# Altium project Vanilla SBC.PrjPcb
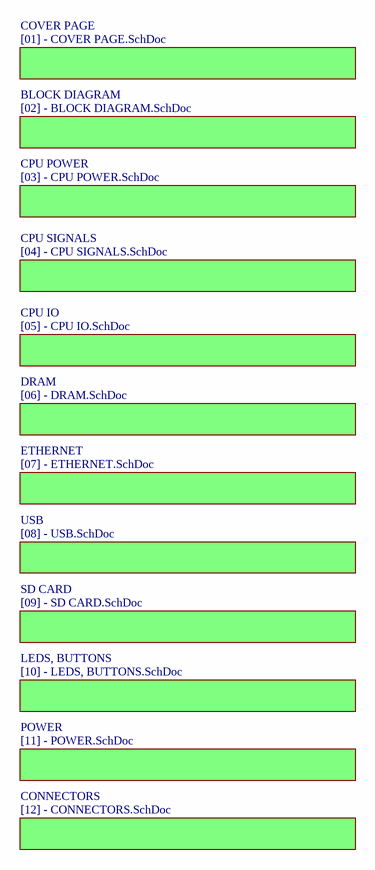
[diagram p0: Vanilla SCB.SchDoc]
13 sheets, 168 parts. Net scope: flat (ports and power ports of the same name join across sheets).
Board file: Vanilla SCB.PcbDoc
Sheets:
  Vanilla SCB.SchDoc
    COVER PAGE = [01] - COVER PAGE.SchDoc
    BLOCK DIAGRAM = [02] - BLOCK DIAGRAM.SchDoc
    CPU POWER = [03] - CPU POWER.SchDoc
    CPU SIGNALS = [04] - CPU SIGNALS.SchDoc
    CPU IO = [05] - CPU IO.SchDoc
    DRAM = [06] - DRAM.SchDoc
    ETHERNET = [07] - ETHERNET.SchDoc
    USB = [08] - USB.SchDoc
    SD CARD = [09] - SD CARD.SchDoc
    LEDS, BUTTONS = [10] - LEDS, BUTTONS.SchDoc
    POWER = [11] - POWER.SchDoc
    CONNECTORS = [12] - CONNECTORS.SchDoc

## Sheet Vanilla SCB.SchDoc: Vanilla SCB
size A4; Organization: Bjørn T. Brodtkorb; Address1: Frode Rinnans veg 161; Address2: 7050 Trondheim; DocumentNumber: 1; Revision: 1.0; SheetNumber: 1; SheetTotal: 13

### Sub-sheets
BLOCK DIAGRAM = [02] - BLOCK DIAGRAM.SchDoc: no entries
CONNECTORS = [12] - CONNECTORS.SchDoc: no entries
COVER PAGE = [01] - COVER PAGE.SchDoc: no entries
CPU IO = [05] - CPU IO.SchDoc: no entries
CPU POWER = [03] - CPU POWER.SchDoc: no entries
CPU SIGNALS = [04] - CPU SIGNALS.SchDoc: no entries
DRAM = [06] - DRAM.SchDoc: no entries
ETHERNET = [07] - ETHERNET.SchDoc: no entries
LEDS, BUTTONS = [10] - LEDS, BUTTONS.SchDoc: no entries
POWER = [11] - POWER.SchDoc: no entries
SD CARD = [09] - SD CARD.SchDoc: no entries
USB = [08] - USB.SchDoc: no entries

### Notes on the sheet
- Title
- Size:
- Date:
- A4
- Number:
- Time:
- Revision:
- Sheet
- of
- StrawberryHacker
- File:

## Sheet [01] - COVER PAGE.SchDoc: Vanilla SCB
size A4; Organization: Bjørn T. Brodtkorb; Address1: Frode Rinnans veg 161; Address2: 7050 Trondheim; DocumentNumber: 2; Revision: 1.0; SheetNumber: 2; SheetTotal: 13
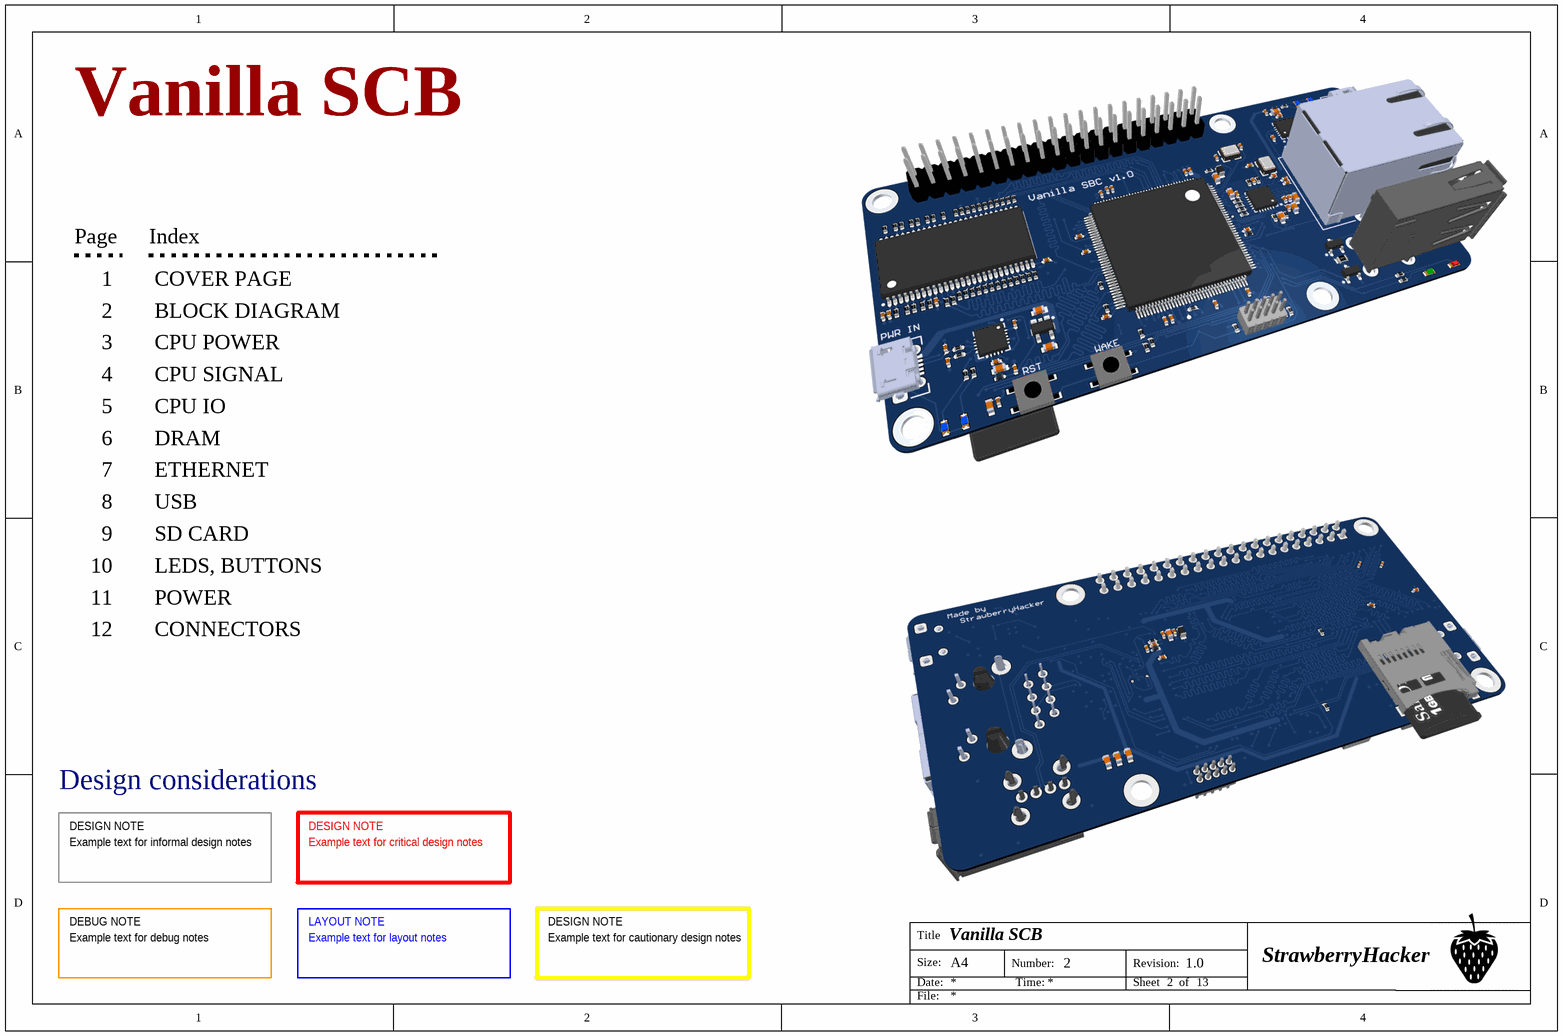
[diagram p1: [01] - COVER PAGE.SchDoc]

### Notes on the sheet
- Vanilla SCB
- Page
- Index
- 1
- COVER PAGE
- Top side
- 2
- 3
- 4
- BLOCK DIAGRAM
- CPU POWER
- CPU SIGNAL
- 5
- 6
- CPU IO
- DRAM
- 7
- 8
- ETHERNET
- USB
- 10
- 9
- SD CARD
- LEDS, BUTTONS
- 11
- 12
- POWER
- CONNECTORS
- Bottom side
- Design considerations
- DESIGN NOTE
- Example text for informal design notes
- Example text for critical design notes
- DEBUG NOTE
- Example text for debug notes
- LAYOUT NOTE
- Example text for layout notes
- Example text for cautionary design notes
- Title
- Size:
- Date:
- A4
- Number:
- Time:
- Revision:
- Sheet
- of
- StrawberryHacker
- File:

## Sheet [02] - BLOCK DIAGRAM.SchDoc: BLOCK DIAGRAM
size A4; Organization: Bjørn T. Brodtkorb; Address1: Frode Rinnans veg 161; Address2: 7050 Trondheim; DocumentNumber: 3; Revision: 1.0; SheetNumber: 3; SheetTotal: 13
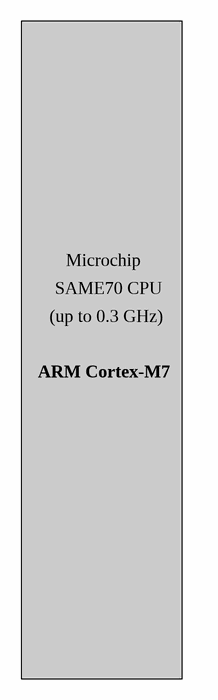
[diagram p2: [02] - BLOCK DIAGRAM.SchDoc]

### Notes on the sheet
- Microchip
- (up to 0.3 GHz)
- SAME70 CPU
- ARM Cortex-M7
- Title
- Size:
- Date:
- A4
- Number:
- Time:
- Revision:
- Sheet
- of
- StrawberryHacker
- File:

## Sheet [03] - CPU POWER.SchDoc: CPU POWER
size A4; Organization: Bjørn T. Brodtkorb; Address1: Frode Rinnans veg 161; Address2: 7050 Trondheim; DocumentNumber: 4; Revision: 1.0; SheetNumber: 4; SheetTotal: 13
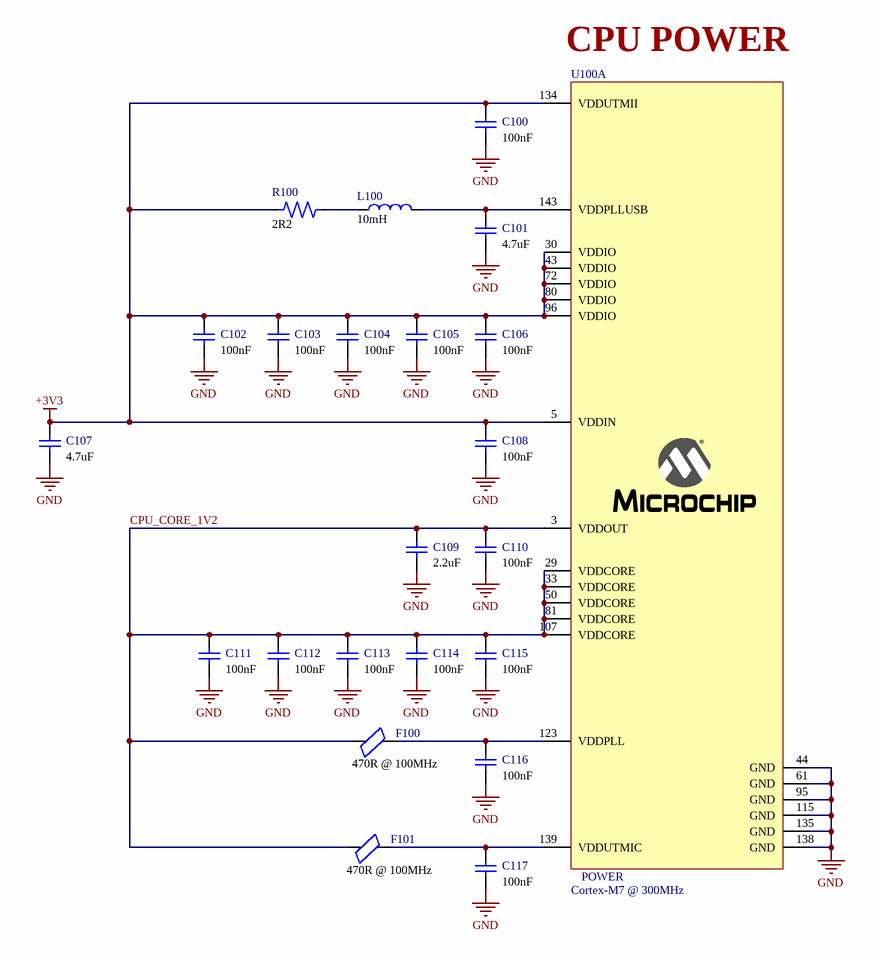
[diagram p3: [03] - CPU POWER.SchDoc]

### Parts
C100  value 100nF  [C0402]  (hidden comment: 04023C103KAT2A)
C101  value 4.7uF  [C0603]  (hidden comment: 02016D104KAT2A)
C102  value 100nF  [C0402]  (hidden comment: 04023C103KAT2A)
C103  value 100nF  [C0402]  (hidden comment: 04023C103KAT2A)
C104  value 100nF  [C0402]  (hidden comment: 04023C103KAT2A)
C105  value 100nF  [C0402]  (hidden comment: 04023C103KAT2A)
C106  value 100nF  [C0402]  (hidden comment: 04023C103KAT2A)
C107  value 4.7uF  [C0603]  (hidden comment: 02016D104KAT2A)
C108  value 100nF  [C0402]  (hidden comment: 04023C103KAT2A)
C109  value 2.2uF  [C0402]  (hidden comment: 04023C103KAT2A)
C110  value 100nF  [C0402]  (hidden comment: 04023C103KAT2A)
C111  value 100nF  [C0402]  (hidden comment: 04023C103KAT2A)
C112  value 100nF  [C0402]  (hidden comment: 04023C103KAT2A)
C113  value 100nF  [C0402]  (hidden comment: 04023C103KAT2A)
C114  value 100nF  [C0402]  (hidden comment: 04023C103KAT2A)
C115  value 100nF  [C0402]  (hidden comment: 04023C103KAT2A)
C116  value 100nF  [C0402]  (hidden comment: 04023C103KAT2A)
C117  value 100nF  [C0402]  (hidden comment: 04023C103KAT2A)
F100  value 470R @ 100MHz  [Ferrite bead 0402]  (hidden comment: BLM15AG102SN1D)
F101  value 470R @ 100MHz  [Ferrite bead 0402]  (hidden comment: BLM15AG102SN1D)
L100  value 10mH  [Inductor 0603]  (hidden comment: MLZ1608A2R2WT)
R100  value 2R2  [R0402]  (hidden comment: CRCW04020000Z0ED)
U100  Cortex-M7 @ 300MHz  [ATSAMS70Q21A-AN]  (part A of 4)

### Nets
+3V3: C100.2 C102.2 C103.2 C104.2 C105.2 C106.2 C107.2 C108.2 R100.1 U100.5(VDDIN) U100.30(VDDIO) U100.43(VDDIO) U100.72(VDDIO) U100.80(VDDIO) U100.96(VDDIO) U100.134(VDDUTMII)
GND: C100.1 C101.1 C102.1 C103.1 C104.1 C105.1 C106.1 C107.1 C108.1 C109.1 C110.1 C111.1 C112.1 C113.1 C114.1 C115.1 C116.1 C117.1 U100.44(GND) U100.61(GND) U100.95(GND) U100.115(GND) U100.135(GND) U100.138(GND)
CPU_CORE_1V2: C109.2 C110.2 C111.2 C112.2 C113.2 C114.2 C115.2 F100.1 F101.1 U100.3(VDDOUT) U100.29(VDDCORE) U100.33(VDDCORE) U100.50(VDDCORE) U100.81(VDDCORE) U100.107(VDDCORE)
NetC101_2: C101.2 L100.2 U100.143(VDDPLLUSB)
NetC116_2: C116.2 F100.2 U100.123(VDDPLL)
NetC117_2: C117.2 F101.2 U100.139(VDDUTMIC)
NetL100_1: L100.1 R100.2

### Notes on the sheet
- (near U100) CPU POWER
- Title
- Size:
- Date:
- A4
- Number:
- Time:
- Revision:
- Sheet
- of
- StrawberryHacker
- File:
- (in symbol ATSAMS70Q21A-AN, part A) POWER

### Library data of the parts
C100 C102-C106 C108-C117 = 04023C103KAT2A: C0402
C101 C107 = 02016D104KAT2A: C0603
F100 F101 = BLM15AG102SN1D: Ferrite bead 0402
L100 = MLZ1608A2R2WT: Inductor 0603
R100 = CRCW04020000Z0ED: R0402
U100 = ATSAMS70Q21A-AN: ATSAMS70Q21; Supplier Part Number 1: 2484397; Supplier 1: Farnell

## Sheet [04] - CPU SIGNALS.SchDoc: CPU SIGNALS
size A4; Organization: Bjørn T. Brodtkorb; Address1: Frode Rinnans veg 161; Address2: 7050 Trondheim; DocumentNumber: 5; Revision: 1.0; SheetNumber: 5; SheetTotal: 13
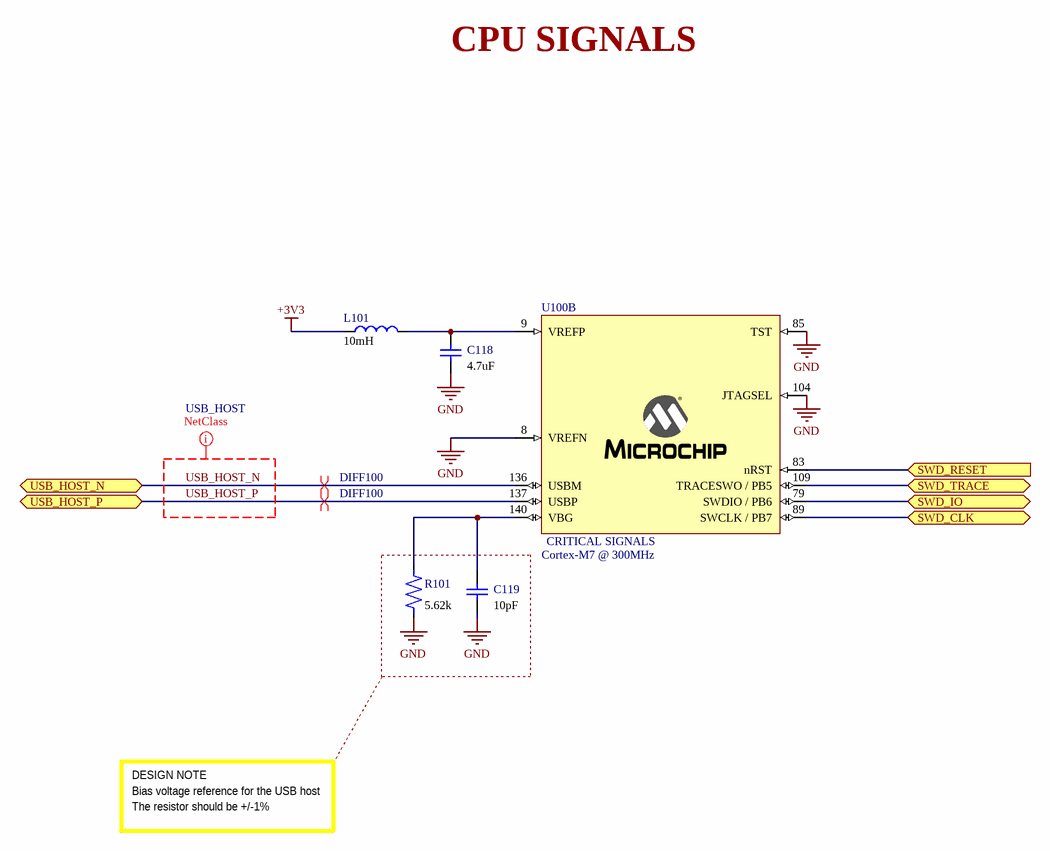
[diagram p4: [04] - CPU SIGNALS.SchDoc]

### Parts
C118  value 4.7uF  [C0402]  (hidden comment: 04023C103KAT2A)
C119  value 10pF  [C0402]  (hidden comment: 04023C103KAT2A)
L101  value 10mH  [Inductor 0603]  (hidden comment: MLZ1608A2R2WT)
R101  value 5.62k  [R0402]  (hidden comment: CRCW04020000Z0ED)
U100  Cortex-M7 @ 300MHz  [ATSAMS70Q21A-AN]  (part B of 4)

### Ports
SWD_CLK (bidir), SWD_IO (bidir), SWD_RESET (in), SWD_TRACE (bidir), USB_HOST_N (bidir), USB_HOST_P (bidir)

### Nets
+3V3: L101.1
GND: C118.1 C119.1 R101.1 U100.8(VREFN) U100.85(TST) U100.104(JTAGSEL)
USB_HOST_N: U100.136(USBM) ; port USB_HOST_N
USB_HOST_P: U100.137(USBP) ; port USB_HOST_P
NetC118_2: C118.2 L101.2 U100.9(VREFP)
NetC119_2: C119.2 R101.2 U100.140(VBG)
NetJ105_2: U100.79(SWDIO_/_PB6) ; port SWD_IO
NetJ105_4: U100.89(SWCLK_/_PB7) ; port SWD_CLK
NetJ105_6: U100.109(TRACESWO_/_PB5) ; port SWD_TRACE
NetJ105_10: U100.83(nRST) ; port SWD_RESET

### Layout directives
differential pair; differential pair class DIFF100: USB_HOST_N, USB_HOST_P
net class USB_HOST: USB_HOST_N, USB_HOST_P

### Notes on the sheet
- CPU SIGNALS
- DESIGN NOTE
- Bias voltage reference for the USB host
- The resistor should be +/-1%
- Title
- Size:
- Date:
- A4
- Number:
- Time:
- Revision:
- Sheet
- of
- StrawberryHacker
- File:
- (in symbol ATSAMS70Q21A-AN, part B) CRITICAL SIGNALS

### Library data of the parts
C118 C119 = 04023C103KAT2A: C0402
L101 = MLZ1608A2R2WT: Inductor 0603
R101 = CRCW04020000Z0ED: R0402
U100 = ATSAMS70Q21A-AN: ATSAMS70Q21; Supplier Part Number 1: 2484397; Supplier 1: Farnell

## Sheet [05] - CPU IO.SchDoc: CPU IO
size A4; Organization: Bjørn T. Brodtkorb; Address1: Frode Rinnans veg 161; Address2: 7050 Trondheim; DocumentNumber: 6; Revision: 1.0; SheetNumber: 6; SheetTotal: 13
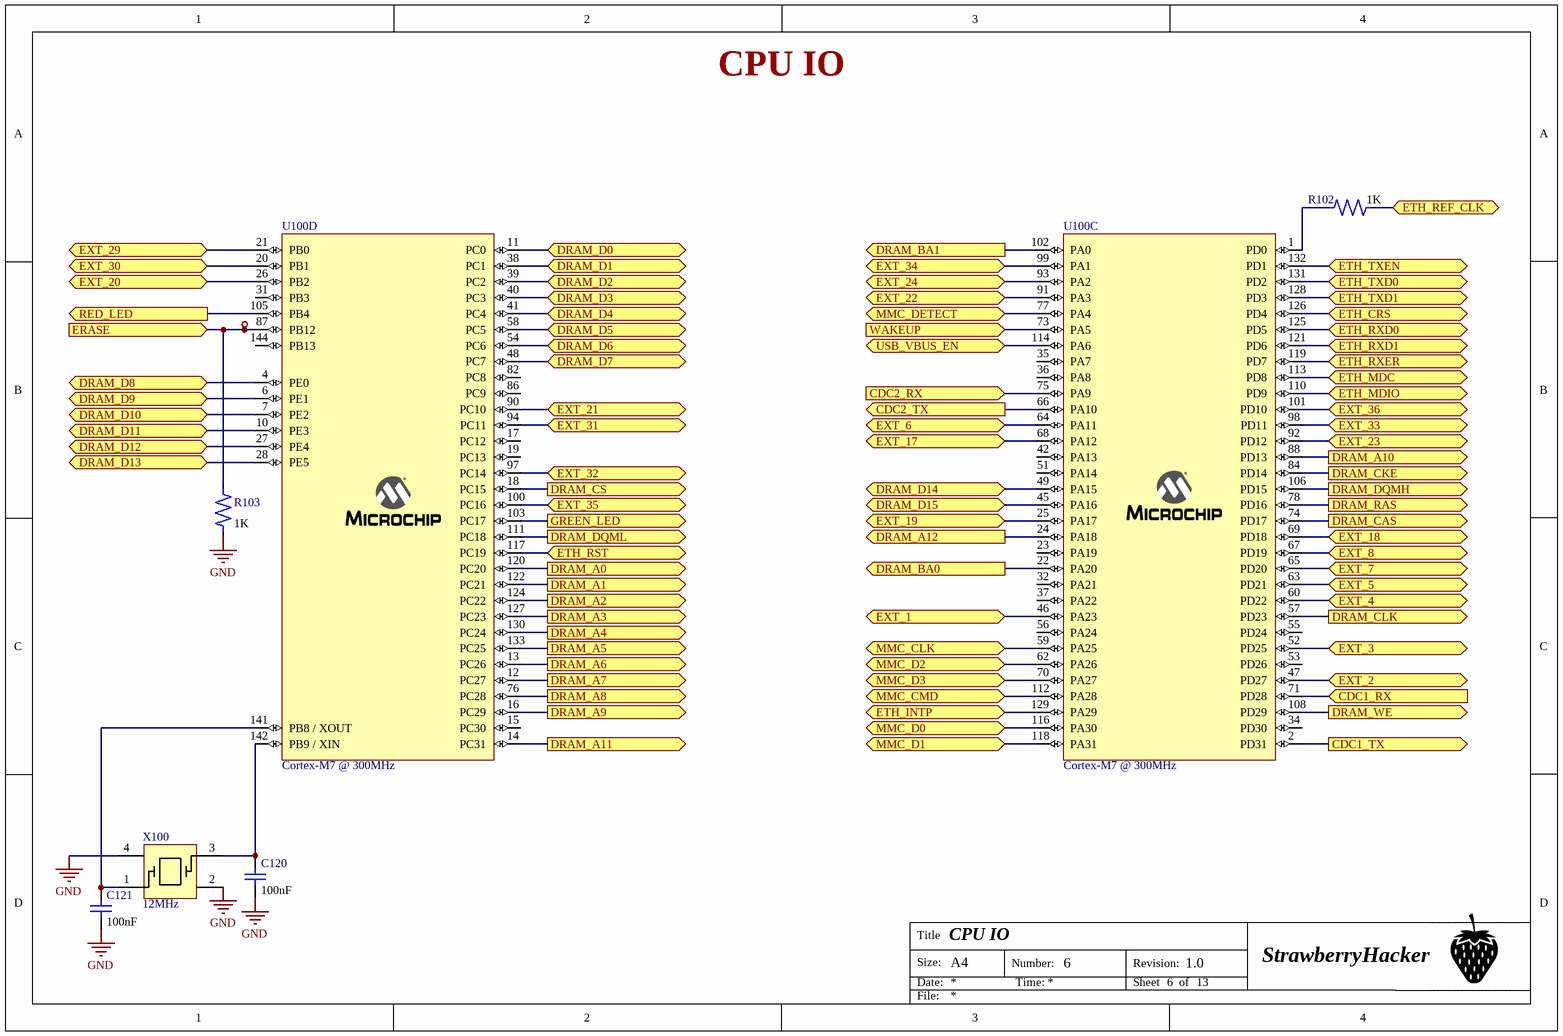
[diagram p5: [05] - CPU IO.SchDoc]

### Parts
C120  value 100nF  [C0402]  (hidden comment: 04023C103KAT2A)
C121  value 100nF  [C0402]  (hidden comment: 04023C103KAT2A)
R102  value 1K  [R0402]  (hidden comment: CRCW04020000Z0ED)
R103  value 1K  [R0402]  (hidden comment: CRCW04020000Z0ED)
TP100  Test point  [TEST POINT]  (value not drawn)
U100  Cortex-M7 @ 300MHz  [ATSAMS70Q21A-AN]  (parts C,D of 4)
X100  12MHz  [MCSJK-7U-12.00-12-30-80-B-30]

### Ports
CDC1_RX (in), CDC1_TX (out), CDC2_RX (in), CDC2_TX (out), DRAM_A0 (out), DRAM_A1 (out), DRAM_A2 (out), DRAM_A3 (out), DRAM_A4 (out), DRAM_A5 (out), DRAM_A6 (out), DRAM_A7 (out), DRAM_A8 (out), DRAM_A9 (out), DRAM_A10 (out), DRAM_A11 (out), DRAM_A12 (out), DRAM_BA0 (out), DRAM_BA1 (out), DRAM_CAS (out), DRAM_CKE (out), DRAM_CLK (out), DRAM_CS (out), DRAM_D0 (bidir), DRAM_D1 (bidir), DRAM_D2 (bidir), DRAM_D3 (bidir), DRAM_D4 (bidir), DRAM_D5 (bidir), DRAM_D6 (bidir), DRAM_D7 (bidir), DRAM_D8 (bidir), DRAM_D9 (bidir), DRAM_D10 (bidir), DRAM_D11 (bidir), DRAM_D12 (bidir), DRAM_D13 (bidir), DRAM_D14 (bidir), DRAM_D15 (bidir), DRAM_DQMH (out), DRAM_DQML (out), DRAM_RAS (out), DRAM_WE (out), ERASE (in), ETH_CRS (bidir), ETH_INTP (bidir), ETH_MDC (bidir), ETH_MDIO (bidir), ETH_REF_CLK (bidir), ETH_RST (bidir), ETH_RXD0 (bidir), ETH_RXD1 (bidir), ETH_RXER (bidir), ETH_TXD0 (bidir), ETH_TXD1 (bidir), ETH_TXEN (bidir), EXT_1 (bidir), EXT_2 (bidir), EXT_3 (bidir), EXT_4 (bidir), EXT_5 (bidir), EXT_6 (bidir), EXT_7 (bidir), EXT_8 (bidir), EXT_17 (bidir), EXT_18 (bidir), EXT_19 (bidir), EXT_20 (bidir), EXT_21 (bidir), EXT_22 (bidir), EXT_23 (bidir), EXT_24 (bidir), EXT_29 (bidir), EXT_30 (bidir), EXT_31 (bidir), EXT_32 (bidir), EXT_33 (bidir), EXT_34 (bidir), EXT_35 (bidir), EXT_36 (bidir), GREEN_LED (out), MMC_CLK (bidir), MMC_CMD (bidir), MMC_D0 (bidir), MMC_D1 (bidir), MMC_D2 (bidir), MMC_D3 (bidir), MMC_DETECT (bidir), RED_LED (out), USB_VBUS_EN (bidir), WAKEUP (in)

### Nets
GND: C120.1 C121.1 R103.1 X100.2 X100.4
DRAM_A0: U100.120(PC20) ; port DRAM_A0
DRAM_A1: U100.122(PC21) ; port DRAM_A1
DRAM_A2: U100.124(PC22) ; port DRAM_A2
DRAM_A3: U100.127(PC23) ; port DRAM_A3
DRAM_A4: U100.130(PC24) ; port DRAM_A4
DRAM_A5: U100.133(PC25) ; port DRAM_A5
DRAM_A6: U100.13(PC26) ; port DRAM_A6
DRAM_A7: U100.12(PC27) ; port DRAM_A7
DRAM_A8: U100.76(PC28) ; port DRAM_A8
DRAM_A9: U100.16(PC29) ; port DRAM_A9
DRAM_A10: U100.88(PD13) ; port DRAM_A10
DRAM_A11: U100.14(PC31) ; port DRAM_A11
DRAM_A12: U100.24(PA18) ; port DRAM_A12
DRAM_BA0: U100.22(PA20) ; port DRAM_BA0
DRAM_BA1: U100.102(PA0) ; port DRAM_BA1
DRAM_CAS: U100.74(PD17) ; port DRAM_CAS
DRAM_CKE: U100.84(PD14) ; port DRAM_CKE
DRAM_CLK: U100.57(PD23) ; port DRAM_CLK
DRAM_CS: U100.18(PC15) ; port DRAM_CS
DRAM_D0: U100.11(PC0) ; port DRAM_D0
DRAM_D1: U100.38(PC1) ; port DRAM_D1
DRAM_D2: U100.39(PC2) ; port DRAM_D2
DRAM_D3: U100.40(PC3) ; port DRAM_D3
DRAM_D4: U100.41(PC4) ; port DRAM_D4
DRAM_D5: U100.58(PC5) ; port DRAM_D5
DRAM_D6: U100.54(PC6) ; port DRAM_D6
DRAM_D7: U100.48(PC7) ; port DRAM_D7
DRAM_D8: U100.4(PE0) ; port DRAM_D8
DRAM_D9: U100.6(PE1) ; port DRAM_D9
DRAM_D10: U100.7(PE2) ; port DRAM_D10
DRAM_D11: U100.10(PE3) ; port DRAM_D11
DRAM_D12: U100.27(PE4) ; port DRAM_D12
DRAM_D13: U100.28(PE5) ; port DRAM_D13
DRAM_D14: U100.49(PA15) ; port DRAM_D14
DRAM_D15: U100.45(PA16) ; port DRAM_D15
DRAM_DQMH: U100.106(PD15) ; port DRAM_DQMH
DRAM_DQML: U100.111(PC18) ; port DRAM_DQML
DRAM_RAS: U100.78(PD16) ; port DRAM_RAS
DRAM_WE: U100.108(PD29) ; port DRAM_WE
ETH_CRS: U100.126(PD4) ; port ETH_CRS
ETH_INTP: U100.129(PA29) ; port ETH_INTP
ETH_MDC: U100.113(PD8) ; port ETH_MDC
ETH_MDIO: U100.110(PD9) ; port ETH_MDIO
ETH_REF_CLK: R102.2 ; port ETH_REF_CLK
ETH_RST: U100.117(PC19) ; port ETH_RST
ETH_RXD0: U100.125(PD5) ; port ETH_RXD0
ETH_RXD1: U100.121(PD6) ; port ETH_RXD1
ETH_RXER: U100.119(PD7) ; port ETH_RXER
ETH_TXD0: U100.131(PD2) ; port ETH_TXD0
ETH_TXD1: U100.128(PD3) ; port ETH_TXD1
ETH_TXEN: U100.132(PD1) ; port ETH_TXEN
MMC_CLK: U100.59(PA25) ; port MMC_CLK
MMC_CMD: U100.112(PA28) ; port MMC_CMD
MMC_D0: U100.116(PA30) ; port MMC_D0
MMC_D1: U100.118(PA31) ; port MMC_D1
MMC_D2: U100.62(PA26) ; port MMC_D2
MMC_D3: U100.70(PA27) ; port MMC_D3
NetC120_2: C120.2 U100.142(PB9_/_XIN) X100.3
NetC121_2: C121.2 U100.141(PB8_/_XOUT) X100.1
NetJ101_9: U100.77(PA4) ; port MMC_DETECT
NetJ102_1: U100.46(PA23) ; port EXT_1
NetJ102_2: U100.47(PD27) ; port EXT_2
NetJ102_3: U100.52(PD25) ; port EXT_3
NetJ102_4: U100.60(PD22) ; port EXT_4
NetJ102_5: U100.63(PD21) ; port EXT_5
NetJ102_6: U100.64(PA11) ; port EXT_6
NetJ102_7: U100.65(PD20) ; port EXT_7
NetJ102_8: U100.67(PD19) ; port EXT_8
NetJ102_17: U100.68(PA12) ; port EXT_17
NetJ102_18: U100.69(PD18) ; port EXT_18
NetJ102_19: U100.25(PA17) ; port EXT_19
NetJ102_20: U100.26(PB2) ; port EXT_20
NetJ102_21: U100.90(PC10) ; port EXT_21
NetJ102_22: U100.91(PA3) ; port EXT_22
NetJ102_23: U100.92(PD12) ; port EXT_23
NetJ102_24: U100.93(PA2) ; port EXT_24
NetJ102_29: U100.21(PB0) ; port EXT_29
NetJ102_30: U100.20(PB1) ; port EXT_30
NetJ102_31: U100.94(PC11) ; port EXT_31
NetJ102_32: U100.97(PC14) ; port EXT_32
NetJ102_33: U100.98(PD11) ; port EXT_33
NetJ102_34: U100.99(PA1) ; port EXT_34
NetJ102_35: U100.100(PC16) ; port EXT_35
NetJ102_36: U100.101(PD10) ; port EXT_36
NetR102_1: R102.1 U100.1(PD0)
NetR103_2: R103.2 TP100.1 U100.87(PB12) ; port ERASE
NetR167_1: U100.105(PB4) ; port RED_LED
NetR168_1: U100.103(PC17) ; port GREEN_LED
NetSW101_1: U100.73(PA5) ; port WAKEUP
NetT101_1: U100.114(PA6) ; port USB_VBUS_EN
NetU100_2: U100.2(PD31) ; port CDC1_TX
NetU100_66: U100.66(PA10) ; port CDC2_TX
NetU100_71: U100.71(PD28) ; port CDC1_RX
NetU100_75: U100.75(PA9) ; port CDC2_RX

Not connected (* = marked no-connect by the designer): U100 15(PC30) 17(PC12) 19(PC13) 23(PA19) 31(PB3) 32(PA21) 34(PD30) 35(PA7) 36(PA8) 37(PA22) 42(PA13) 51(PA14) 53(PD26) 55(PD24) 56(PA24) 82(PC8) 86(PC9) 144(PB13)

### Notes on the sheet
- CPU IO
- Title
- Size:
- Date:
- A4
- Number:
- Time:
- Revision:
- Sheet
- of
- StrawberryHacker
- File:

### Library data of the parts
C120 C121 = 04023C103KAT2A: C0402
R102 R103 = CRCW04020000Z0ED: R0402
U100 = ATSAMS70Q21A-AN: ATSAMS70Q21; Supplier Part Number 1: 2484397; Supplier 1: Farnell
X100 = MCSJK-7U-12.00-12-30-80-B-30: Crystal 12MHz 3.2mm x 2.5mm; Supplier Part Number 1: 2853917; Supplier 1: Farnell

## Sheet [06] - DRAM.SchDoc: DRAM
size A4; Organization: Bjørn T. Brodtkorb; Address1: Frode Rinnans veg 161; Address2: 7050 Trondheim; DocumentNumber: 7; Revision: 1.0; SheetNumber: 7; SheetTotal: 13
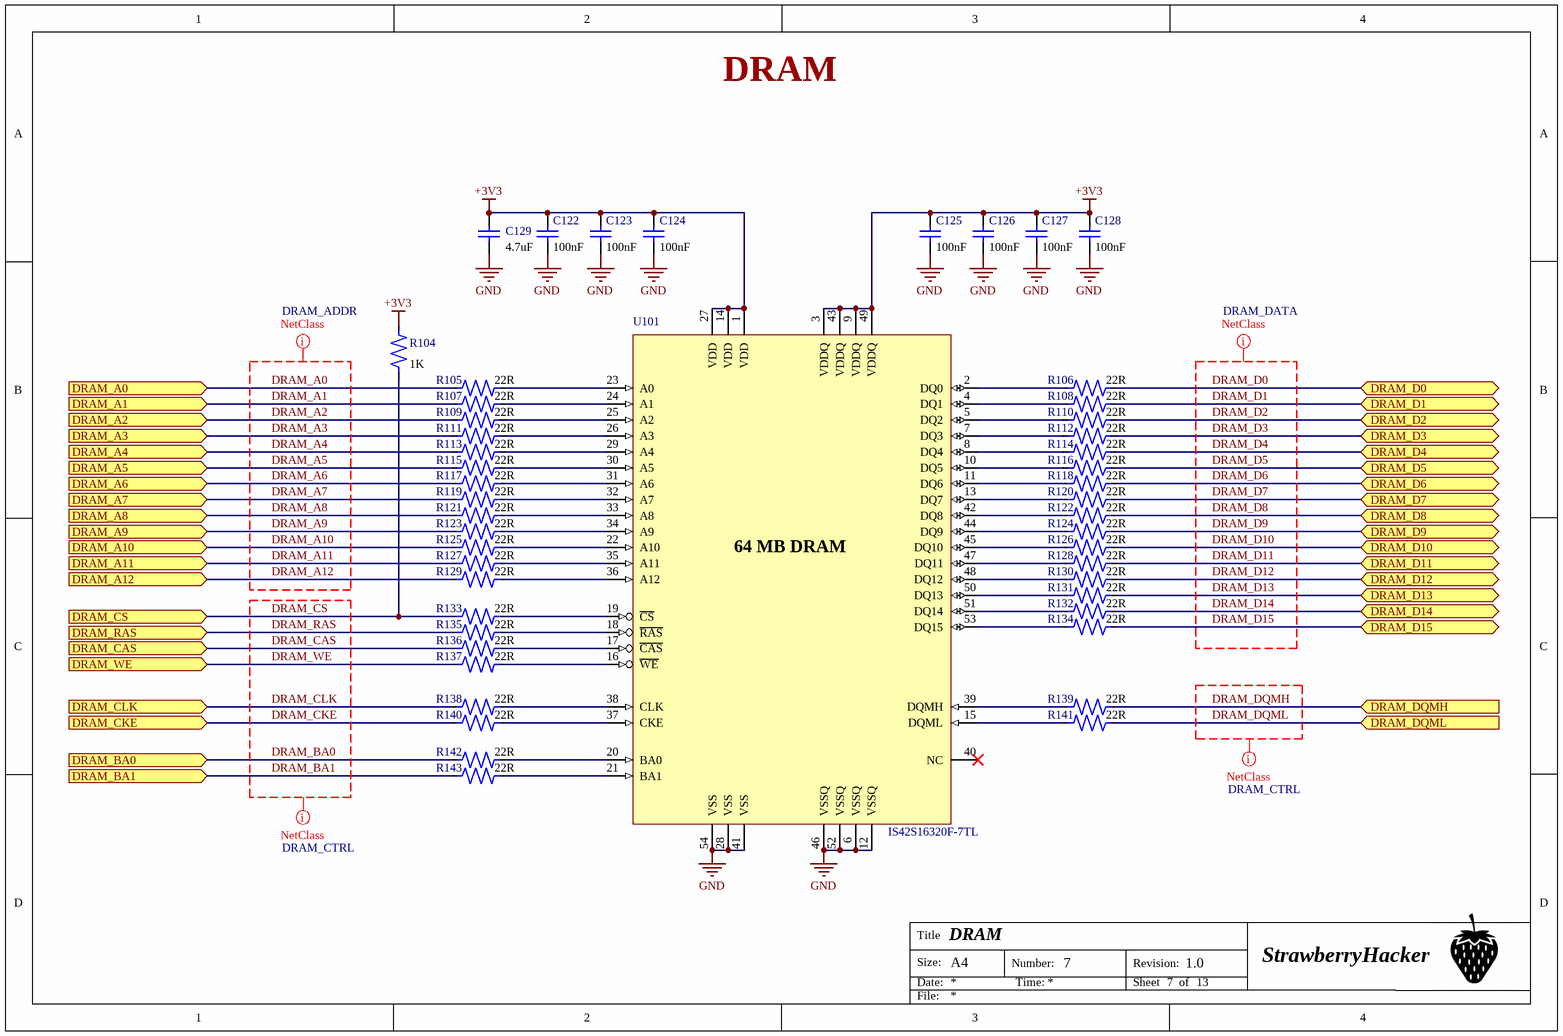
[diagram p6: [06] - DRAM.SchDoc]

### Parts
C122  value 100nF  [C0402]  (hidden comment: 04023C103KAT2A)
C123  value 100nF  [C0402]  (hidden comment: 04023C103KAT2A)
C124  value 100nF  [C0402]  (hidden comment: 04023C103KAT2A)
C125  value 100nF  [C0402]  (hidden comment: 04023C103KAT2A)
C126  value 100nF  [C0402]  (hidden comment: 04023C103KAT2A)
C127  value 100nF  [C0402]  (hidden comment: 04023C103KAT2A)
C128  value 100nF  [C0402]  (hidden comment: 04023C103KAT2A)
C129  value 4.7uF  [C0402]  (hidden comment: 04023C103KAT2A)
R104  value 1K  [R0402]  (hidden comment: CRCW04020000Z0ED)
R105  value 22R  [R0402]  (hidden comment: CRCW04020000Z0ED)
R106  value 22R  [R0402]  (hidden comment: CRCW04020000Z0ED)
R107  value 22R  [R0402]  (hidden comment: CRCW04020000Z0ED)
R108  value 22R  [R0402]  (hidden comment: CRCW04020000Z0ED)
R109  value 22R  [R0402]  (hidden comment: CRCW04020000Z0ED)
R110  value 22R  [R0402]  (hidden comment: CRCW04020000Z0ED)
R111  value 22R  [R0402]  (hidden comment: CRCW04020000Z0ED)
R112  value 22R  [R0402]  (hidden comment: CRCW04020000Z0ED)
R113  value 22R  [R0402]  (hidden comment: CRCW04020000Z0ED)
R114  value 22R  [R0402]  (hidden comment: CRCW04020000Z0ED)
R115  value 22R  [R0402]  (hidden comment: CRCW04020000Z0ED)
R116  value 22R  [R0402]  (hidden comment: CRCW04020000Z0ED)
R117  value 22R  [R0402]  (hidden comment: CRCW04020000Z0ED)
R118  value 22R  [R0402]  (hidden comment: CRCW04020000Z0ED)
R119  value 22R  [R0402]  (hidden comment: CRCW04020000Z0ED)
R120  value 22R  [R0402]  (hidden comment: CRCW04020000Z0ED)
R121  value 22R  [R0402]  (hidden comment: CRCW04020000Z0ED)
R122  value 22R  [R0402]  (hidden comment: CRCW04020000Z0ED)
R123  value 22R  [R0402]  (hidden comment: CRCW04020000Z0ED)
R124  value 22R  [R0402]  (hidden comment: CRCW04020000Z0ED)
R125  value 22R  [R0402]  (hidden comment: CRCW04020000Z0ED)
R126  value 22R  [R0402]  (hidden comment: CRCW04020000Z0ED)
R127  value 22R  [R0402]  (hidden comment: CRCW04020000Z0ED)
R128  value 22R  [R0402]  (hidden comment: CRCW04020000Z0ED)
R129  value 22R  [R0402]  (hidden comment: CRCW04020000Z0ED)
R130  value 22R  [R0402]  (hidden comment: CRCW04020000Z0ED)
R131  value 22R  [R0402]  (hidden comment: CRCW04020000Z0ED)
R132  value 22R  [R0402]  (hidden comment: CRCW04020000Z0ED)
R133  value 22R  [R0402]  (hidden comment: CRCW04020000Z0ED)
R134  value 22R  [R0402]  (hidden comment: CRCW04020000Z0ED)
R135  value 22R  [R0402]  (hidden comment: CRCW04020000Z0ED)
R136  value 22R  [R0402]  (hidden comment: CRCW04020000Z0ED)
R137  value 22R  [R0402]  (hidden comment: CRCW04020000Z0ED)
R138  value 22R  [R0402]  (hidden comment: CRCW04020000Z0ED)
R139  value 22R  [R0402]  (hidden comment: CRCW04020000Z0ED)
R140  value 22R  [R0402]  (hidden comment: CRCW04020000Z0ED)
R141  value 22R  [R0402]  (hidden comment: CRCW04020000Z0ED)
R142  value 22R  [R0402]  (hidden comment: CRCW04020000Z0ED)
R143  value 22R  [R0402]  (hidden comment: CRCW04020000Z0ED)
U101  IS42S16320F-7TL  [IS42S16320F-7TL]

### Ports
DRAM_A0 (in), DRAM_A1 (in), DRAM_A2 (in), DRAM_A3 (in), DRAM_A4 (in), DRAM_A5 (in), DRAM_A6 (in), DRAM_A7 (in), DRAM_A8 (in), DRAM_A9 (in), DRAM_A10 (in), DRAM_A11 (in), DRAM_A12 (in), DRAM_BA0 (in), DRAM_BA1 (in), DRAM_CAS (in), DRAM_CKE (in), DRAM_CLK (in), DRAM_CS (in), DRAM_D0 (bidir), DRAM_D1 (bidir), DRAM_D2 (bidir), DRAM_D3 (bidir), DRAM_D4 (bidir), DRAM_D5 (bidir), DRAM_D6 (bidir), DRAM_D7 (bidir), DRAM_D8 (bidir), DRAM_D9 (bidir), DRAM_D10 (bidir), DRAM_D11 (bidir), DRAM_D12 (bidir), DRAM_D13 (bidir), DRAM_D14 (bidir), DRAM_D15 (bidir), DRAM_DQMH (in), DRAM_DQML (in), DRAM_RAS (in), DRAM_WE (in)

### Nets
+3V3: C122.2 C123.2 C124.2 C125.2 C126.2 C127.2 C128.2 C129.2 R104.2 U101.1(VDD) U101.3(VDDQ) U101.9(VDDQ) U101.14(VDD) U101.27(VDD) U101.43(VDDQ) U101.49(VDDQ)
GND: C122.1 C123.1 C124.1 C125.1 C126.1 C127.1 C128.1 C129.1 U101.6(VSSQ) U101.12(VSSQ) U101.28(VSS) U101.41(VSS) U101.46(VSSQ) U101.52(VSSQ) U101.54(VSS)
DRAM_A0: R105.1 ; port DRAM_A0
DRAM_A1: R107.1 ; port DRAM_A1
DRAM_A2: R109.1 ; port DRAM_A2
DRAM_A3: R111.1 ; port DRAM_A3
DRAM_A4: R113.1 ; port DRAM_A4
DRAM_A5: R115.1 ; port DRAM_A5
DRAM_A6: R117.1 ; port DRAM_A6
DRAM_A7: R119.1 ; port DRAM_A7
DRAM_A8: R121.1 ; port DRAM_A8
DRAM_A9: R123.1 ; port DRAM_A9
DRAM_A10: R125.1 ; port DRAM_A10
DRAM_A11: R127.1 ; port DRAM_A11
DRAM_A12: R129.1 ; port DRAM_A12
DRAM_BA0: R142.1 ; port DRAM_BA0
DRAM_BA1: R143.1 ; port DRAM_BA1
DRAM_CAS: R136.1 ; port DRAM_CAS
DRAM_CKE: R140.1 ; port DRAM_CKE
DRAM_CLK: R138.1 ; port DRAM_CLK
DRAM_CS: R104.1 R133.1 ; port DRAM_CS
DRAM_D0: R106.2 ; port DRAM_D0
DRAM_D1: R108.2 ; port DRAM_D1
DRAM_D2: R110.2 ; port DRAM_D2
DRAM_D3: R112.2 ; port DRAM_D3
DRAM_D4: R114.2 ; port DRAM_D4
DRAM_D5: R116.2 ; port DRAM_D5
DRAM_D6: R118.2 ; port DRAM_D6
DRAM_D7: R120.2 ; port DRAM_D7
DRAM_D8: R122.2 ; port DRAM_D8
DRAM_D9: R124.2 ; port DRAM_D9
DRAM_D10: R126.2 ; port DRAM_D10
DRAM_D11: R128.2 ; port DRAM_D11
DRAM_D12: R130.2 ; port DRAM_D12
DRAM_D13: R131.2 ; port DRAM_D13
DRAM_D14: R132.2 ; port DRAM_D14
DRAM_D15: R134.2 ; port DRAM_D15
DRAM_DQMH: R139.2 ; port DRAM_DQMH
DRAM_DQML: R141.2 ; port DRAM_DQML
DRAM_RAS: R135.1 ; port DRAM_RAS
DRAM_WE: R137.1 ; port DRAM_WE
NetR105_2: R105.2 U101.23(A0)
NetR106_1: R106.1 U101.2(DQ0)
NetR107_2: R107.2 U101.24(A1)
NetR108_1: R108.1 U101.4(DQ1)
NetR109_2: R109.2 U101.25(A2)
NetR110_1: R110.1 U101.5(DQ2)
NetR111_2: R111.2 U101.26(A3)
NetR112_1: R112.1 U101.7(DQ3)
NetR113_2: R113.2 U101.29(A4)
NetR114_1: R114.1 U101.8(DQ4)
NetR115_2: R115.2 U101.30(A5)
NetR116_1: R116.1 U101.10(DQ5)
NetR117_2: R117.2 U101.31(A6)
NetR118_1: R118.1 U101.11(DQ6)
NetR119_2: R119.2 U101.32(A7)
NetR120_1: R120.1 U101.13(DQ7)
NetR121_2: R121.2 U101.33(A8)
NetR122_1: R122.1 U101.42(DQ8)
NetR123_2: R123.2 U101.34(A9)
NetR124_1: R124.1 U101.44(DQ9)
NetR125_2: R125.2 U101.22(A10)
NetR126_1: R126.1 U101.45(DQ10)
NetR127_2: R127.2 U101.35(A11)
NetR128_1: R128.1 U101.47(DQ11)
NetR129_2: R129.2 U101.36(A12)
NetR130_1: R130.1 U101.48(DQ12)
NetR131_1: R131.1 U101.50(DQ13)
NetR132_1: R132.1 U101.51(DQ14)
NetR133_2: R133.2 U101.19(~{CS})
NetR134_1: R134.1 U101.53(DQ15)
NetR135_2: R135.2 U101.18(~{RAS})
NetR136_2: R136.2 U101.17(~{CAS})
NetR137_2: R137.2 U101.16(~{WE})
NetR138_2: R138.2 U101.38(CLK)
NetR139_1: R139.1 U101.39(DQMH)
NetR140_2: R140.2 U101.37(CKE)
NetR141_1: R141.1 U101.15(DQML)
NetR142_2: R142.2 U101.20(BA0)
NetR143_2: R143.2 U101.21(BA1)

Not connected (* = marked no-connect by the designer): U101 40(NC)*

### Layout directives
net class DRAM_ADDR: DRAM_A0, DRAM_A1, DRAM_A2, DRAM_A3, DRAM_A4, DRAM_A5, DRAM_A6, DRAM_A7, DRAM_A8, DRAM_A9, DRAM_A10, DRAM_A11, DRAM_A12
net class DRAM_CTRL: DRAM_BA0, DRAM_BA1, DRAM_CAS, DRAM_CKE, DRAM_CLK, DRAM_CS, DRAM_DQMH, DRAM_DQML, DRAM_RAS, DRAM_WE
net class DRAM_DATA: DRAM_D0, DRAM_D1, DRAM_D2, DRAM_D3, DRAM_D4, DRAM_D5, DRAM_D6, DRAM_D7, DRAM_D8, DRAM_D9, DRAM_D10, DRAM_D11, DRAM_D12, DRAM_D13, DRAM_D14, DRAM_D15

### Notes on the sheet
- DRAM
- Title
- Size:
- Date:
- A4
- Number:
- Time:
- Revision:
- Sheet
- of
- StrawberryHacker
- File:
- (in symbol IS42S16320F-7TL) 64 MB DRAM

### Library data of the parts
C122-C129 = 04023C103KAT2A: C0402
R104-R143 = CRCW04020000Z0ED: R0402
U101 = IS42S16320F-7TL: SDRAM 512Mb 32Mx16 TSOP; Clock cycle time: 7.5 ns; Clock frequency: 143 MHz; Supplier 1: Digi-Key; Supplier Part Number 1: 706-1450-5-ND

## Sheet [07] - ETHERNET.SchDoc: ETHERNET
size A4; Organization: Bjørn T. Brodtkorb; Address1: Frode Rinnans veg 161; Address2: 7050 Trondheim; DocumentNumber: 8; Revision: 1.0; SheetNumber: 8; SheetTotal: 13
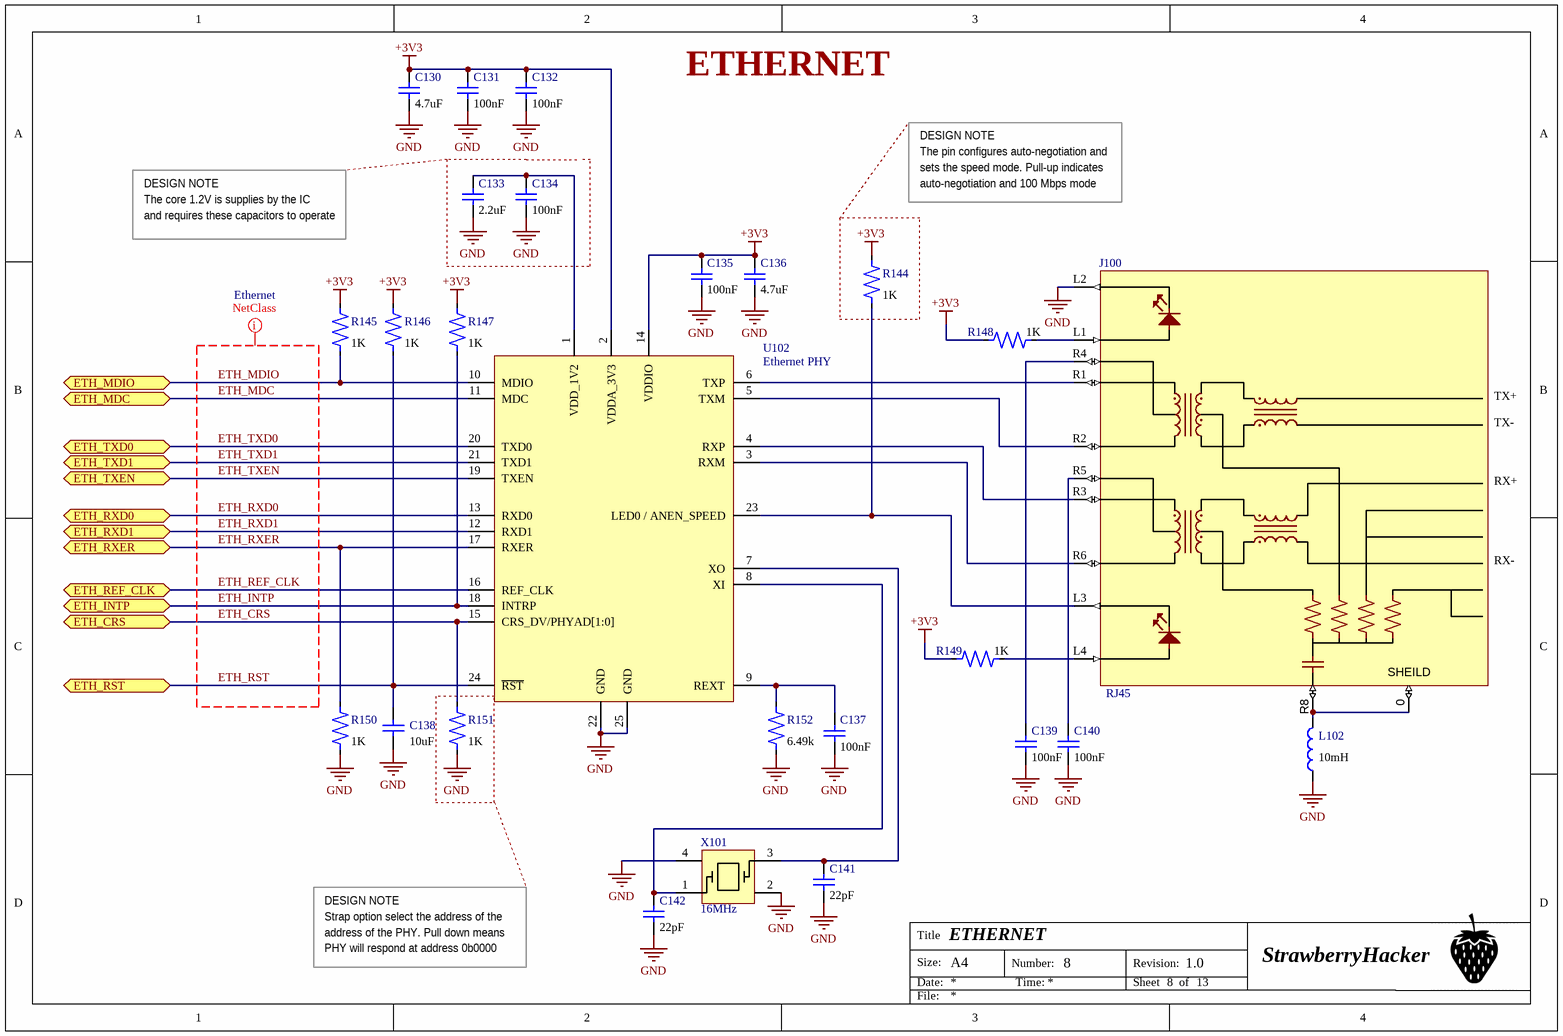
[diagram p7: [07] - ETHERNET.SchDoc]

### Parts
C130  value 4.7uF  [C0603]  (hidden comment: 02016D104KAT2A)
C131  value 100nF  [C0402]  (hidden comment: 04023C103KAT2A)
C132  value 100nF  [C0402]  (hidden comment: 04023C103KAT2A)
C133  value 2.2uF  [C0603]  (hidden comment: 02016D104KAT2A)
C134  value 100nF  [C0402]  (hidden comment: 04023C103KAT2A)
C135  value 100nF  [C0402]  (hidden comment: 04023C103KAT2A)
C136  value 4.7uF  [C0603]  (hidden comment: 02016D104KAT2A)
C137  value 100nF  [C0402]  (hidden comment: 04023C103KAT2A)
C138  value 10uF  [C0603]  (hidden comment: 02016D104KAT2A)
C139  value 100nF  [C0402]  (hidden comment: 04023C103KAT2A)
C140  value 100nF  [C0402]  (hidden comment: 04023C103KAT2A)
C141  value 22pF  [C0402]  (hidden comment: 04023C103KAT2A)
C142  value 22pF  [C0402]  (hidden comment: 04023C103KAT2A)
J100  RJ45  [RJ45 8P8C LED & magnetics]
L102  value 10mH  [Inductor 0603]  (hidden comment: MLZ1608A2R2WT)
R144  value 1K  [R0402]  (hidden comment: CRCW04020000Z0ED)
R145  value 1K  [R0402]  (hidden comment: CRCW04020000Z0ED)
R146  value 1K  [R0402]  (hidden comment: CRCW04020000Z0ED)
R147  value 1K  [R0402]  (hidden comment: CRCW04020000Z0ED)
R148  value 1K  [R0402]  (hidden comment: CRCW04020000Z0ED)
R149  value 1K  [R0402]  (hidden comment: CRCW04020000Z0ED)
R150  value 1K  [R0402]  (hidden comment: CRCW04020000Z0ED)
R151  value 1K  [R0402]  (hidden comment: CRCW04020000Z0ED)
R152  value 6.49k  [R0402]  (hidden comment: CRCW04020000Z0ED)
U102  Ethernet PHY  [KSZ8081RNACA]
X101  16MHz  [MCSJK-7U-16.00-12-10-80-B-10]

### Ports
ETH_CRS (bidir), ETH_INTP (bidir), ETH_MDC (bidir), ETH_MDIO (bidir), ETH_REF_CLK (bidir), ETH_RST (bidir), ETH_RXD0 (bidir), ETH_RXD1 (bidir), ETH_RXER (bidir), ETH_TXD0 (bidir), ETH_TXD1 (bidir), ETH_TXEN (bidir)

### Nets
+3V3: C130.2 C131.2 C132.2 C135.2 C136.2 R144.2 R145.2 R146.2 R147.2 R148.1 R149.1 U102.2(VDDA_3V3) U102.14(VDDIO)
GND: C130.1 C131.1 C132.1 C133.1 C134.1 C135.1 C136.1 C137.1 C138.1 C139.1 C140.1 C141.1 C142.1 J100.L2 L102.1 R150.1 R151.1 R152.1 U102.22(GND) U102.25(GND) X101.2 X101.4
ETH_CRS: R151.2 U102.15(CRS_DV/PHYAD[1:0]) ; port ETH_CRS
ETH_INTP: R147.1 U102.18(INTRP) ; port ETH_INTP
ETH_MDC: U102.11(MDC) ; port ETH_MDC
ETH_MDIO: R145.1 U102.10(MDIO) ; port ETH_MDIO
ETH_REF_CLK: U102.16(REF_CLK) ; port ETH_REF_CLK
ETH_RST: C138.2 R146.1 U102.24(~{RST}) ; port ETH_RST
ETH_RXD0: U102.13(RXD0) ; port ETH_RXD0
ETH_RXD1: U102.12(RXD1) ; port ETH_RXD1
ETH_RXER: R150.2 U102.17(RXER) ; port ETH_RXER
ETH_TXD0: U102.20(TXD0) ; port ETH_TXD0
ETH_TXD1: U102.21(TXD1) ; port ETH_TXD1
ETH_TXEN: U102.19(TXEN) ; port ETH_TXEN
NetC133_2: C133.2 C134.2 U102.1(VDD_1V2)
NetC137_2: C137.2 R152.2 U102.9(REXT)
NetC139_2: C139.2 J100.R4
NetC140_2: C140.2 J100.R5
NetC141_2: C141.2 U102.7(XO) X101.3
NetC142_2: C142.2 U102.8(XI) X101.1
NetJ100_0: J100.0 J100.R8 L102.2
NetJ100_L1: J100.L1 R148.2
NetJ100_L3: J100.L3 R144.1 U102.23(LED0_/_ANEN_SPEED)
NetJ100_L4: J100.L4 R149.2
NetJ100_R1: J100.R1 U102.6(TXP)
NetJ100_R2: J100.R2 U102.5(TXM)
NetJ100_R3: J100.R3 U102.4(RXP)
NetJ100_R6: J100.R6 U102.3(RXM)

Not connected (* = marked no-connect by the designer): J100 1 2

### Layout directives
net class Ethernet: ETH_CRS, ETH_INTP, ETH_MDC, ETH_MDIO, ETH_REF_CLK, ETH_RST, ETH_RXD0, ETH_RXD1, ETH_RXER, ETH_TXD0, ETH_TXD1, ETH_TXEN

### Notes on the sheet
- ETHERNET
- DESIGN NOTE
- The pin configures auto-negotiation and
- sets the speed mode. Pull-up indicates
- The core 1.2V is supplies by the IC
- and requires these capacitors to operate
- auto-negotiation and 100 Mbps mode
- Strap option select the address of the
- address of the PHY. Pull down means
- PHY will respond at address 0b0000
- Title
- Size:
- Date:
- A4
- Number:
- Time:
- Revision:
- Sheet
- of
- StrawberryHacker
- File:
- (in symbol 234235-2-2-1-12) TX+; TX-; RX+; RX-; SHEILD

### Library data of the parts
C130 C133 C136 C138 = 02016D104KAT2A: C0603
C131 C132 C134 C135 C137 C139-C142 = 04023C103KAT2A: C0402
J100 = 234235-2-2-1-12: RJ45 8P8C LED & magnetics; Supplier 1: Digi-Key; Supplier Part Number 1: RJMG1BD3B8K1ANR-ND
L102 = MLZ1608A2R2WT: Inductor 0603
R144-R152 = CRCW04020000Z0ED: R0402
U102 = KSZ8081RNACA: Ethernet PHY 10BASE-T/100BASE; Supplier 1: Farnell; Supplier Part Number 1: 2809920
X101 = MCSJK-7U-16.00-12-10-80-B-10_1: Crystal 25MHx 3.2mm x 2.5mm, 16pF; Supplier 1: Farnell; Supplier Part Number 1: 1674655

## Sheet [08] - USB.SchDoc: USB
size A4; Organization: Bjørn T. Brodtkorb; Address1: Frode Rinnans veg 161; Address2: 7050 Trondheim; DocumentNumber: 9; Revision: 1.0; SheetNumber: 9; SheetTotal: 13
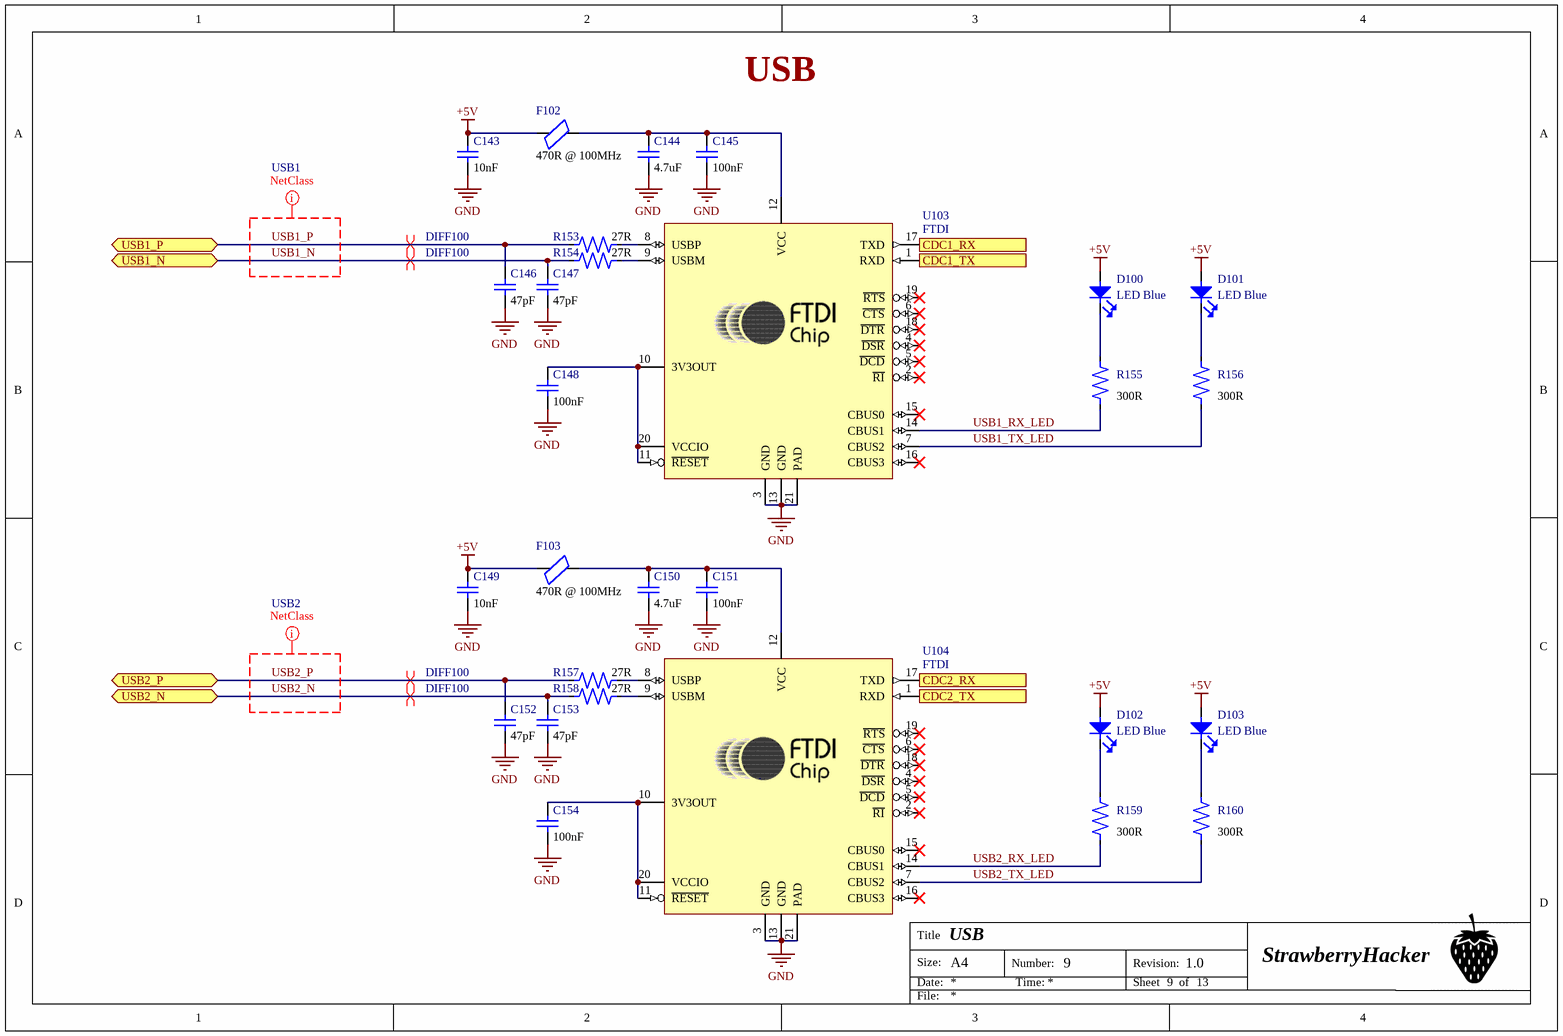
[diagram p8: [08] - USB.SchDoc]

### Parts
C143  value 10nF  [C0402]  (hidden comment: 04023C103KAT2A)
C144  value 4.7uF  [C0603]  (hidden comment: 02016D104KAT2A)
C145  value 100nF  [C0402]  (hidden comment: 04023C103KAT2A)
C146  value 47pF  [C0402]  (hidden comment: 04023C103KAT2A)
C147  value 47pF  [C0402]  (hidden comment: 04023C103KAT2A)
C148  value 100nF  [C0402]  (hidden comment: 04023C103KAT2A)
C149  value 10nF  [C0402]  (hidden comment: 04023C103KAT2A)
C150  value 4.7uF  [C0603]  (hidden comment: 02016D104KAT2A)
C151  value 100nF  [C0402]  (hidden comment: 04023C103KAT2A)
C152  value 47pF  [C0402]  (hidden comment: 04023C103KAT2A)
C153  value 47pF  [C0402]  (hidden comment: 04023C103KAT2A)
C154  value 100nF  [C0402]  (hidden comment: 04023C103KAT2A)
D100  LED Blue  [L0603 BLUE]
D101  LED Blue  [L0603 BLUE]
D102  LED Blue  [L0603 BLUE]
D103  LED Blue  [L0603 BLUE]
F102  value 470R @ 100MHz  [Ferrite bead 0402]  (hidden comment: BLM15AG102SN1D)
F103  value 470R @ 100MHz  [Ferrite bead 0402]  (hidden comment: BLM15AG102SN1D)
R153  value 27R  [R0402]  (hidden comment: CRCW04020000Z0ED)
R154  value 27R  [R0402]  (hidden comment: CRCW04020000Z0ED)
R155  value 300R  [R0402]  (hidden comment: CRCW04020000Z0ED)
R156  value 300R  [R0402]  (hidden comment: CRCW04020000Z0ED)
R157  value 27R  [R0402]  (hidden comment: CRCW04020000Z0ED)
R158  value 27R  [R0402]  (hidden comment: CRCW04020000Z0ED)
R159  value 300R  [R0402]  (hidden comment: CRCW04020000Z0ED)
R160  value 300R  [R0402]  (hidden comment: CRCW04020000Z0ED)
U103  FTDI  [FT231XQ-R]
U104  FTDI  [FT231XQ-R]

### Ports
CDC1_RX (out), CDC1_TX (in), CDC2_RX (out), CDC2_TX (in), USB1_N (bidir), USB1_P (bidir), USB2_N (bidir), USB2_P (bidir)

### Nets
+5V: C143.2 C149.2 D100.1 D101.1 D102.1 D103.1 F102.1 F103.1
GND: C143.1 C144.1 C145.1 C146.1 C147.1 C148.1 C149.1 C150.1 C151.1 C152.1 C153.1 C154.1 U103.3(GND) U103.13(GND) U103.21(PAD) U104.3(GND) U104.13(GND) U104.21(PAD)
USB1_N: C147.2 R154.1 ; port USB1_N
USB1_P: C146.2 R153.1 ; port USB1_P
USB1_RX_LED: R155.1 U103.14(CBUS1)
USB1_TX_LED: R156.1 U103.7(CBUS2)
USB2_N: C153.2 R158.1 ; port USB2_N
USB2_P: C152.2 R157.1 ; port USB2_P
USB2_RX_LED: R159.1 U104.14(CBUS1)
USB2_TX_LED: R160.1 U104.7(CBUS2)
NetC144_2: C144.2 C145.2 F102.2 U103.12(VCC)
NetC148_2: C148.2 U103.10(3V3OUT) U103.11(~{RESET}) U103.20(VCCIO)
NetC150_2: C150.2 C151.2 F103.2 U104.12(VCC)
NetC154_2: C154.2 U104.10(3V3OUT) U104.11(~{RESET}) U104.20(VCCIO)
NetD100_2: D100.2 R155.2
NetD101_2: D101.2 R156.2
NetD102_2: D102.2 R159.2
NetD103_2: D103.2 R160.2
NetR153_2: R153.2 U103.8(USBP)
NetR154_2: R154.2 U103.9(USBM)
NetR157_2: R157.2 U104.8(USBP)
NetR158_2: R158.2 U104.9(USBM)
NetU100_2: U103.1(RXD) ; port CDC1_TX
NetU100_66: U104.1(RXD) ; port CDC2_TX
NetU100_71: U103.17(TXD) ; port CDC1_RX
NetU100_75: U104.17(TXD) ; port CDC2_RX

Not connected (* = marked no-connect by the designer): U103 2(~{RI})* 4(~{DSR})* 5(~{DCD})* 6(~{CTS})* 15(CBUS0)* 16(CBUS3)* 18(~{DTR})* 19(~{RTS})*; U104 2(~{RI})* 4(~{DSR})* 5(~{DCD})* 6(~{CTS})* 15(CBUS0)* 16(CBUS3)* 18(~{DTR})* 19(~{RTS})*

### Layout directives
differential pair; differential pair class DIFF100: USB1_N, USB1_P, USB2_N, USB2_P
net class USB1: USB1_N, USB1_P
net class USB2: USB2_N, USB2_P

### Notes on the sheet
- USB
- Title
- Size:
- Date:
- A4
- Number:
- Time:
- Revision:
- Sheet
- of
- StrawberryHacker
- File:

### Library data of the parts
C143 C145-C149 C151-C154 = 04023C103KAT2A: C0402
C144 C150 = 02016D104KAT2A: C0603
D100-D103 = HSMG-C199: LED 0603 Blue
F102 F103 = BLM15AG102SN1D: Ferrite bead 0402
R153-R160 = CRCW04020000Z0ED: R0402
U103 U104 = FT231XQ-R: USB to RS-232 converter; Supplier Part Number 1: 2081330; Supplier 1: Farnell

## Sheet [09] - SD CARD.SchDoc: SD CARD
size A4; Organization: Bjørn T. Brodtkorb; Address1: Frode Rinnans veg 161; Address2: 7050 Trondheim; DocumentNumber: 10; Revision: 1.0; SheetNumber: 10; SheetTotal: 13
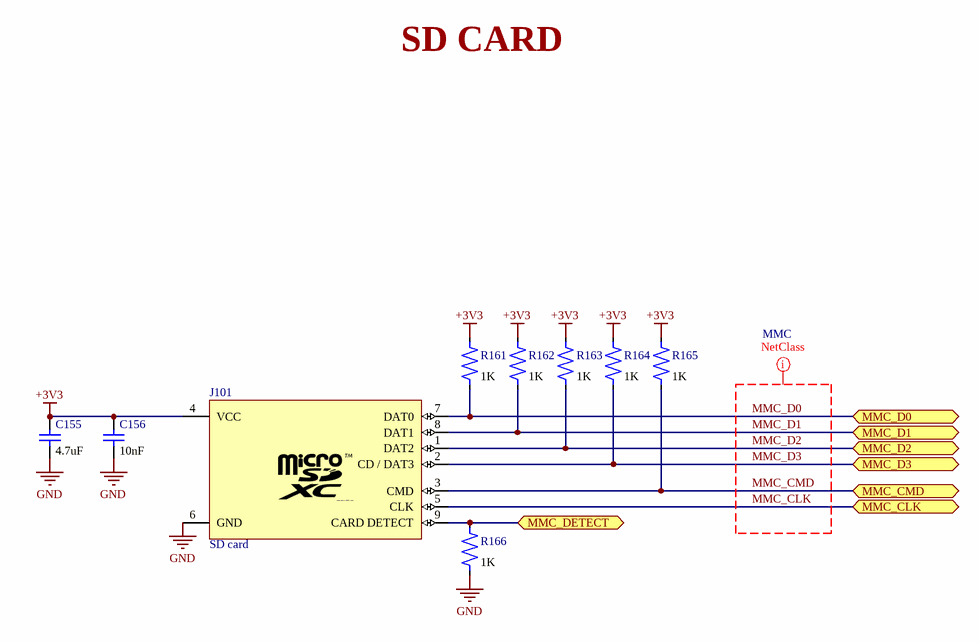
[diagram p9: [09] - SD CARD.SchDoc]

### Parts
C155  value 4.7uF  [C0603]  (hidden comment: 02016D104KAT2A)
C156  value 10nF  [C0402]  (hidden comment: 04023C103KAT2A)
J101  SD card  [SD card push push]
R161  value 1K  [R0402]  (hidden comment: CRCW04020000Z0ED)
R162  value 1K  [R0402]  (hidden comment: CRCW04020000Z0ED)
R163  value 1K  [R0402]  (hidden comment: CRCW04020000Z0ED)
R164  value 1K  [R0402]  (hidden comment: CRCW04020000Z0ED)
R165  value 1K  [R0402]  (hidden comment: CRCW04020000Z0ED)
R166  value 1K  [R0402]  (hidden comment: CRCW04020000Z0ED)

### Ports
MMC_CLK (bidir), MMC_CMD (bidir), MMC_D0 (bidir), MMC_D1 (bidir), MMC_D2 (bidir), MMC_D3 (bidir), MMC_DETECT (bidir)

### Nets
+3V3: C155.2 C156.2 J101.4(VCC) R161.2 R162.2 R163.2 R164.2 R165.2
GND: C155.1 C156.1 J101.6(GND) R166.1
MMC_CLK: J101.5(CLK) ; port MMC_CLK
MMC_CMD: J101.3(CMD) R165.1 ; port MMC_CMD
MMC_D0: J101.7(DAT0) R161.1 ; port MMC_D0
MMC_D1: J101.8(DAT1) R162.1 ; port MMC_D1
MMC_D2: J101.1(DAT2) R163.1 ; port MMC_D2
MMC_D3: J101.2(CD_/_DAT3) R164.1 ; port MMC_D3
NetJ101_9: J101.9(CARD_DETECT) R166.2 ; port MMC_DETECT

### Layout directives
net class MMC: MMC_CLK, MMC_CMD, MMC_D0, MMC_D1, MMC_D2, MMC_D3

### Notes on the sheet
- SD CARD
- Title
- Size:
- Date:
- A4
- Number:
- Time:
- Revision:
- Sheet
- of
- StrawberryHacker
- File:

### Library data of the parts
C155 = 02016D104KAT2A: C0603
C156 = 04023C103KAT2A: C0402
J101 = 47219-2001_1: SD micro card push push; Supplier Part Number 1: 2614940; Supplier 1: Farnell
R161-R166 = CRCW04020000Z0ED: R0402

## Sheet [10] - LEDS, BUTTONS.SchDoc: LEDS, BUTTONS
size A4; Organization: Bjørn T. Brodtkorb; Address1: Frode Rinnans veg 161; Address2: 7050 Trondheim; DocumentNumber: 11; Revision: 1.0; SheetNumber: 11; SheetTotal: 13
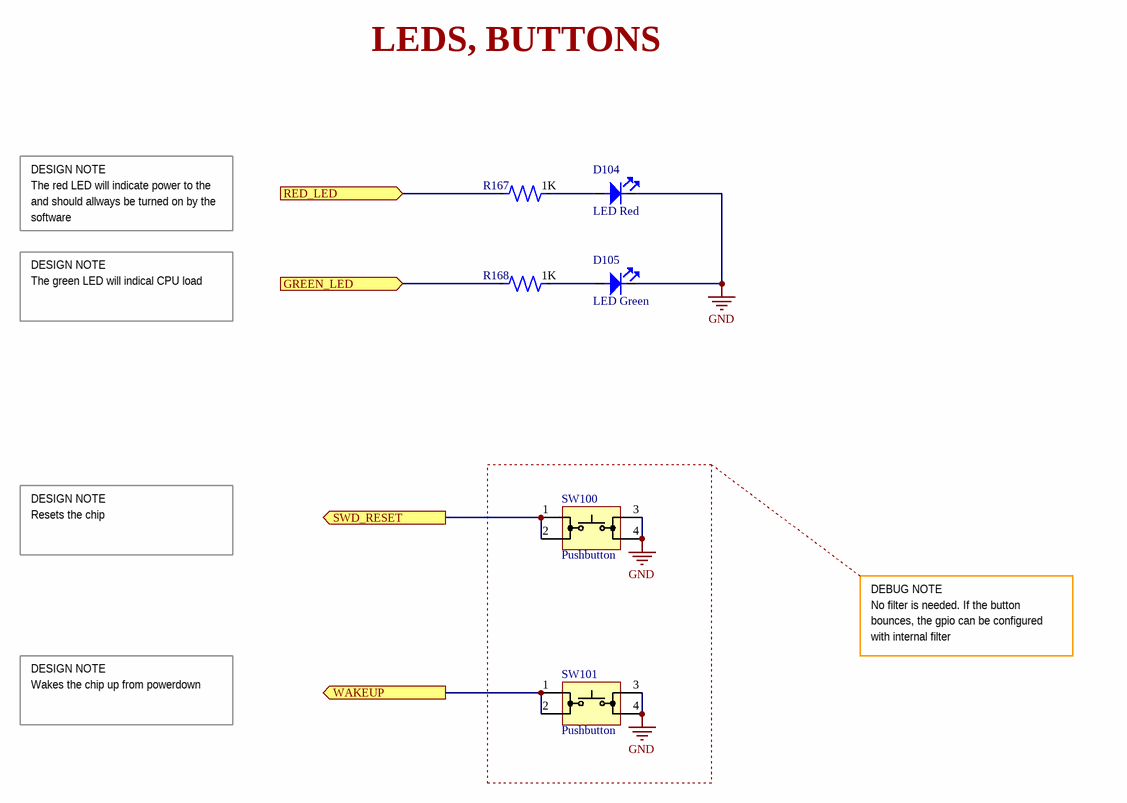
[diagram p10: [10] - LEDS, BUTTONS.SchDoc]

### Parts
D104  LED Red  [L0603 RED]
D105  LED Green  [L0603 GREEN]
R167  value 1K  [R0402]  (hidden comment: CRCW04020000Z0ED)
R168  value 1K  [R0402]  (hidden comment: CRCW04020000Z0ED)
SW100  Pushbutton  [KSC222G LFS]
SW101  Pushbutton  [KSC222G LFS]

### Ports
GREEN_LED (in), RED_LED (in), SWD_RESET (out), WAKEUP (out)

### Nets
GND: D104.2 D105.2 SW100.3 SW100.4 SW101.3 SW101.4
NetD104_1: D104.1 R167.2
NetD105_1: D105.1 R168.2
NetJ105_10: SW100.1 SW100.2 ; port SWD_RESET
NetR167_1: R167.1 ; port RED_LED
NetR168_1: R168.1 ; port GREEN_LED
NetSW101_1: SW101.1 SW101.2 ; port WAKEUP

### Notes on the sheet
- LEDS, BUTTONS
- DESIGN NOTE
- The red LED will indicate power to the
- and should allways be turned on by the
- software
- The green LED will indical CPU load
- Resets the chip
- DEBUG NOTE
- No filter is needed. If the button
- bounces, the gpio can be configured
- Wakes the chip up from powerdown
- with internal filter
- Title
- Size:
- Date:
- A4
- Number:
- Time:
- Revision:
- Sheet
- of
- StrawberryHacker
- File:

### Library data of the parts
D104 = HSMG-C190: LED 0603 Red
D105 = HSMG-C196: LED 0603 Green
R167 R168 = CRCW04020000Z0ED: R0402
SW100 SW101 = KSC222G LFS: Pushbutton SMD; Supplier Part Number 1: 2845714; Supplier 1: Farnell

## Sheet [11] - POWER.SchDoc: POWER
size A4; Organization: Bjørn T. Brodtkorb; Address1: Frode Rinnans veg 161; Address2: 7050 Trondheim; DocumentNumber: 12; Revision: 1.0; SheetNumber: 12; SheetTotal: 13
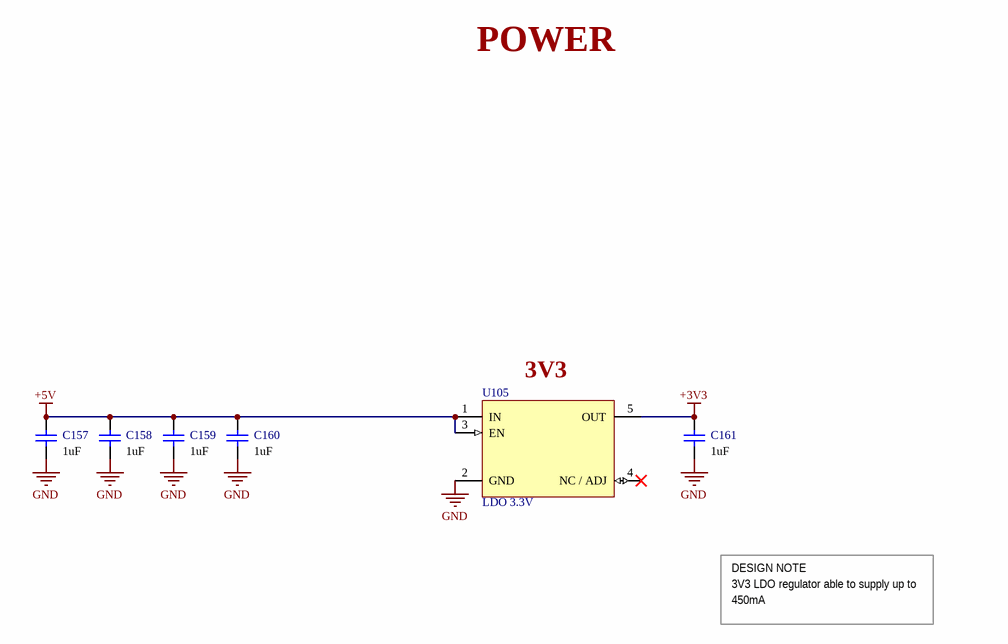
[diagram p11: [11] - POWER.SchDoc]

### Parts
C157  value 1uF  [C0603]  (hidden comment: 02016D104KAT2A)
C158  value 1uF  [C0603]  (hidden comment: 02016D104KAT2A)
C159  value 1uF  [C0603]  (hidden comment: 02016D104KAT2A)
C160  value 1uF  [C0603]  (hidden comment: 02016D104KAT2A)
C161  value 1uF  [C0603]  (hidden comment: 02016D104KAT2A)
U105  LDO 3.3V  [NCV8161BSN330T1G]

### Nets
+3V3: C161.2 U105.5(OUT)
+5V: C157.2 C158.2 C159.2 C160.2 U105.1(IN) U105.3(EN)
GND: C157.1 C158.1 C159.1 C160.1 C161.1 U105.2(GND)

Not connected (* = marked no-connect by the designer): U105 4(NC_/_ADJ)*

### Notes on the sheet
- POWER
- (near U105) 3V3
- DESIGN NOTE
- 3V3 LDO regulator able to supply up to
- 450mA
- Title
- Size:
- Date:
- A4
- Number:
- Time:
- Revision:
- Sheet
- of
- StrawberryHacker
- File:

### Library data of the parts
C157-C161 = 02016D104KAT2A: C0603
U105 = NCV8161BSN330T1G: LDO fixed 3.3V 450mA ultra-low noise; RMS noise: < 100 uVrms; Dropout voltage: 330mV; Supplier Part Number 1: 2775470; Supplier 1: Farnell; Output voltage: 3.3V; Output current: 450mA

## Sheet [12] - CONNECTORS.SchDoc: CONNECTORS
size A4; Organization: Bjørn T. Brodtkorb; Address1: Frode Rinnans veg 161; Address2: 7050 Trondheim; DocumentNumber: 13; Revision: 1.0; SheetNumber: 13; SheetTotal: 13
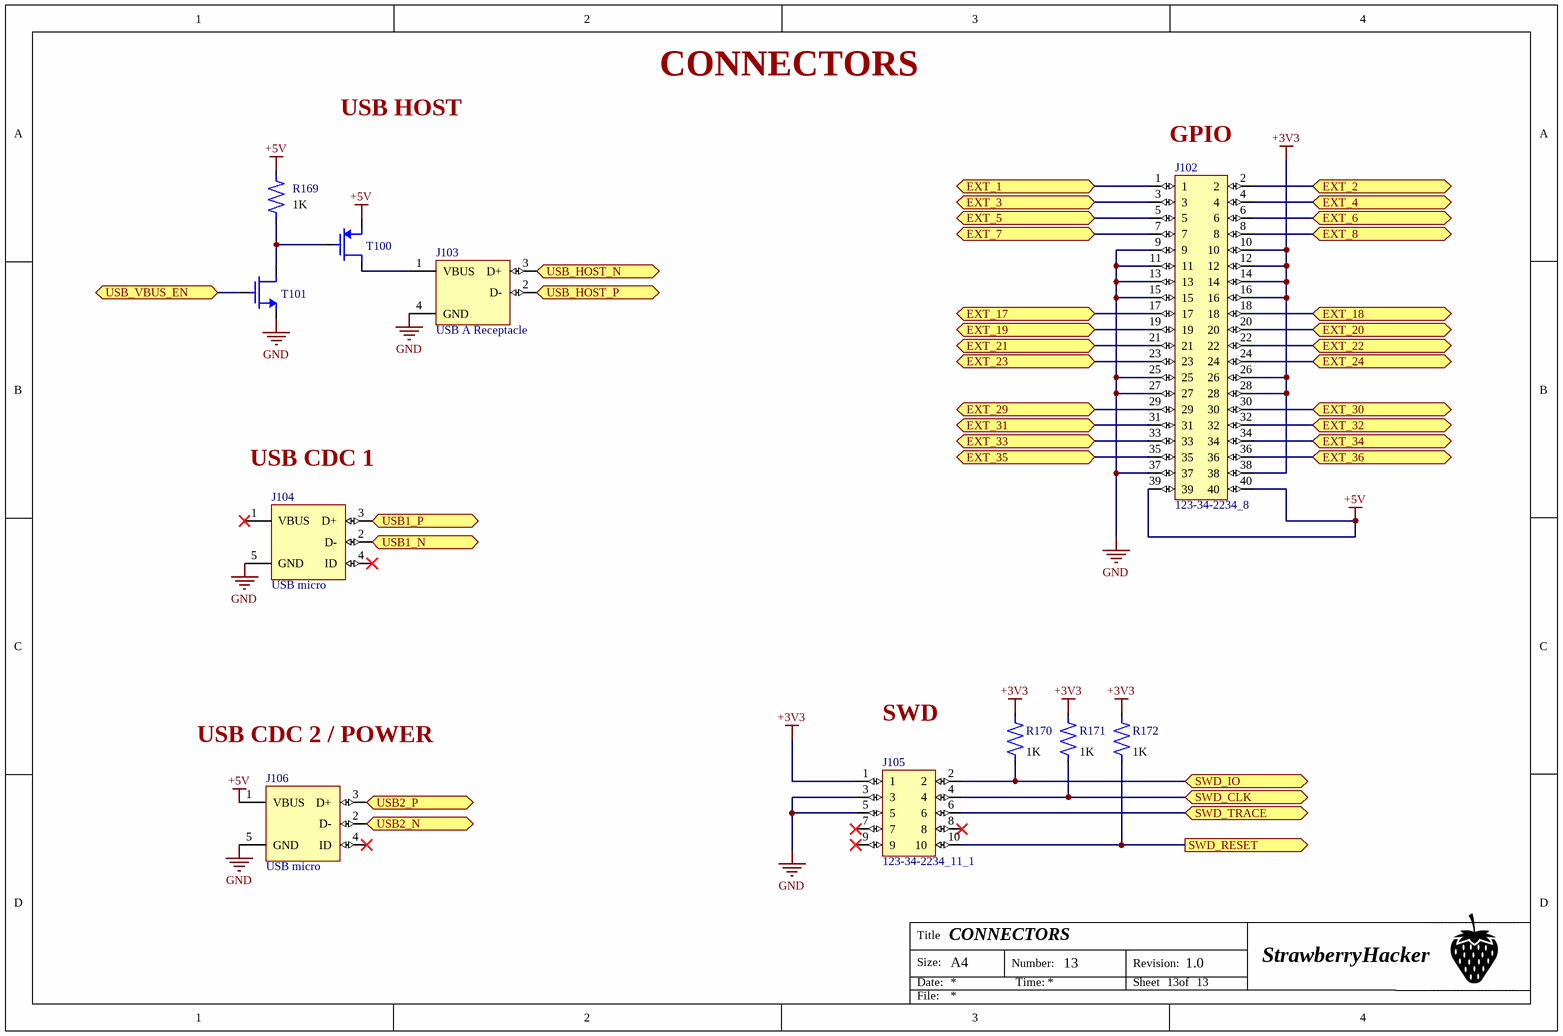
[diagram p12: [12] - CONNECTORS.SchDoc]

### Parts
J102  123-34-2234_8  [Header 2x20 male]
J103  USB A Receptacle  [USB A Right angle]
J104  USB micro  [USB micro]
J105  123-34-2234_11_1  [Header 2x5 male 1.27mm]
J106  USB micro  [USB micro]
R169  value 1K  [R0603]  (hidden comment: CPF-A-0603B100KE1)
R170  value 1K  [R0402]  (hidden comment: CRCW04020000Z0ED)
R171  value 1K  [R0402]  (hidden comment: CRCW04020000Z0ED)
R172  value 1K  [R0402]  (hidden comment: CRCW04020000Z0ED)
T100  DMP1045U  [DMP1045U]  (value not drawn)
T101  DMG6968U  [DMG6968U]  (value not drawn)

### Ports
EXT_1 (bidir), EXT_2 (bidir), EXT_3 (bidir), EXT_4 (bidir), EXT_5 (bidir), EXT_6 (bidir), EXT_7 (bidir), EXT_8 (bidir), EXT_17 (bidir), EXT_18 (bidir), EXT_19 (bidir), EXT_20 (bidir), EXT_21 (bidir), EXT_22 (bidir), EXT_23 (bidir), EXT_24 (bidir), EXT_29 (bidir), EXT_30 (bidir), EXT_31 (bidir), EXT_32 (bidir), EXT_33 (bidir), EXT_34 (bidir), EXT_35 (bidir), EXT_36 (bidir), SWD_CLK (bidir), SWD_IO (bidir), SWD_RESET (out), SWD_TRACE (bidir), USB1_N (bidir), USB1_P (bidir), USB2_N (bidir), USB2_P (bidir), USB_HOST_N (bidir), USB_HOST_P (bidir), USB_VBUS_EN (bidir)

### Nets
+3V3: J102.10 J102.12 J102.14 J102.16 J102.26 J102.28 J102.38 J105.1 R170.2 R171.2 R172.2
+5V: J102.39 J102.40 J106.1(VBUS) R169.2 T100.2(S)
GND: J102.9 J102.11 J102.13 J102.15 J102.25 J102.27 J102.37 J103.4(GND) J104.5(GND) J105.3 J105.5 J106.5(GND) T101.2(S)
USB1_N: J104.2(D-) ; port USB1_N
USB1_P: J104.3(D+) ; port USB1_P
USB2_N: J106.2(D-) ; port USB2_N
USB2_P: J106.3(D+) ; port USB2_P
USB_HOST_N: J103.3(D+) ; port USB_HOST_N
USB_HOST_P: J103.2(D-) ; port USB_HOST_P
NetJ102_1: J102.1 ; port EXT_1
NetJ102_2: J102.2 ; port EXT_2
NetJ102_3: J102.3 ; port EXT_3
NetJ102_4: J102.4 ; port EXT_4
NetJ102_5: J102.5 ; port EXT_5
NetJ102_6: J102.6 ; port EXT_6
NetJ102_7: J102.7 ; port EXT_7
NetJ102_8: J102.8 ; port EXT_8
NetJ102_17: J102.17 ; port EXT_17
NetJ102_18: J102.18 ; port EXT_18
NetJ102_19: J102.19 ; port EXT_19
NetJ102_20: J102.20 ; port EXT_20
NetJ102_21: J102.21 ; port EXT_21
NetJ102_22: J102.22 ; port EXT_22
NetJ102_23: J102.23 ; port EXT_23
NetJ102_24: J102.24 ; port EXT_24
NetJ102_29: J102.29 ; port EXT_29
NetJ102_30: J102.30 ; port EXT_30
NetJ102_31: J102.31 ; port EXT_31
NetJ102_32: J102.32 ; port EXT_32
NetJ102_33: J102.33 ; port EXT_33
NetJ102_34: J102.34 ; port EXT_34
NetJ102_35: J102.35 ; port EXT_35
NetJ102_36: J102.36 ; port EXT_36
NetJ103_1: J103.1(VBUS) T100.3(D)
NetJ105_2: J105.2 R170.1 ; port SWD_IO
NetJ105_4: J105.4 R171.1 ; port SWD_CLK
NetJ105_6: J105.6 ; port SWD_TRACE
NetJ105_10: J105.10 R172.1 ; port SWD_RESET
NetR169_1: R169.1 T100.1(G) T101.3(D)
NetT101_1: T101.1(G) ; port USB_VBUS_EN

Not connected (* = marked no-connect by the designer): J104 1(VBUS)* 4(ID)*; J105 7* 8* 9*; J106 4(ID)*

### Notes on the sheet
- CONNECTORS
- USB HOST
- (near J102) GPIO
- (near J104) USB CDC 1
- (near J106) USB CDC 2 / POWER
- (near J105) SWD
- Title
- Size:
- Date:
- A4
- Number:
- Time:
- Revision:
- Sheet
- of
- StrawberryHacker
- File:

### Library data of the parts
J102 = 123-34-2234_8: Header 2x20 male 2.54mm
J103 = MC32593_1: USB A Right angle; Supplier Part Number 1: 1696534; Supplier 1: Farnell
J104 J106 = 47590-0001: USB B micro; Supplier Part Number 1: 1568022; Supplier 1: Farnell
J105 = 123-34-2234_11_1: Header 2x5 male 1.27mm
R169 = CPF-A-0603B100KE1: R0603
R170-R172 = CRCW04020000Z0ED: R0402
T100 = DMP1045U: PMOS 5.2A -550mV; Threshold voltage: -550mV; Cont. drain current: 5.2A; Supplier Part Number 1: 2061526; Supplier 1: Farnell
T101 = DMG6968U: NMOS 6.5A 500mV; Threshold voltage: 500mV; Cont. drain current: 6.5A; Supplier Part Number 1: 1843757; Supplier 1: Farnell

## Nets that join several sheets
+3V3: [03] - CPU POWER (16 pins), [04] - CPU SIGNALS (L101.1), [06] - DRAM (16 pins), [07] - ETHERNET (13 pins), [09] - SD CARD (8 pins), [11] - POWER (C161.2 U105.5), [12] - CONNECTORS (11 pins)
+5V: [08] - USB (8 pins), [11] - POWER (6 pins), [12] - CONNECTORS (5 pins)
GND: [03] - CPU POWER (24 pins), [04] - CPU SIGNALS (6 pins), [05] - CPU IO (5 pins), [06] - DRAM (15 pins), [07] - ETHERNET (22 pins), [08] - USB (18 pins), [09] - SD CARD (C155.1 C156.1 J101.6 R166.1), [10] - LEDS, BUTTONS (6 pins), [11] - POWER (6 pins), [12] - CONNECTORS (13 pins)
DRAM_A0: [05] - CPU IO (U100.120), [06] - DRAM (R105.1)
DRAM_A1: [05] - CPU IO (U100.122), [06] - DRAM (R107.1)
DRAM_A2: [05] - CPU IO (U100.124), [06] - DRAM (R109.1)
DRAM_A3: [05] - CPU IO (U100.127), [06] - DRAM (R111.1)
DRAM_A4: [05] - CPU IO (U100.130), [06] - DRAM (R113.1)
DRAM_A5: [05] - CPU IO (U100.133), [06] - DRAM (R115.1)
DRAM_A6: [05] - CPU IO (U100.13), [06] - DRAM (R117.1)
DRAM_A7: [05] - CPU IO (U100.12), [06] - DRAM (R119.1)
DRAM_A8: [05] - CPU IO (U100.76), [06] - DRAM (R121.1)
DRAM_A9: [05] - CPU IO (U100.16), [06] - DRAM (R123.1)
DRAM_A10: [05] - CPU IO (U100.88), [06] - DRAM (R125.1)
DRAM_A11: [05] - CPU IO (U100.14), [06] - DRAM (R127.1)
DRAM_A12: [05] - CPU IO (U100.24), [06] - DRAM (R129.1)
DRAM_BA0: [05] - CPU IO (U100.22), [06] - DRAM (R142.1)
DRAM_BA1: [05] - CPU IO (U100.102), [06] - DRAM (R143.1)
DRAM_CAS: [05] - CPU IO (U100.74), [06] - DRAM (R136.1)
DRAM_CKE: [05] - CPU IO (U100.84), [06] - DRAM (R140.1)
DRAM_CLK: [05] - CPU IO (U100.57), [06] - DRAM (R138.1)
DRAM_CS: [05] - CPU IO (U100.18), [06] - DRAM (R104.1 R133.1)
DRAM_D0: [05] - CPU IO (U100.11), [06] - DRAM (R106.2)
DRAM_D1: [05] - CPU IO (U100.38), [06] - DRAM (R108.2)
DRAM_D2: [05] - CPU IO (U100.39), [06] - DRAM (R110.2)
DRAM_D3: [05] - CPU IO (U100.40), [06] - DRAM (R112.2)
DRAM_D4: [05] - CPU IO (U100.41), [06] - DRAM (R114.2)
DRAM_D5: [05] - CPU IO (U100.58), [06] - DRAM (R116.2)
DRAM_D6: [05] - CPU IO (U100.54), [06] - DRAM (R118.2)
DRAM_D7: [05] - CPU IO (U100.48), [06] - DRAM (R120.2)
DRAM_D8: [05] - CPU IO (U100.4), [06] - DRAM (R122.2)
DRAM_D9: [05] - CPU IO (U100.6), [06] - DRAM (R124.2)
DRAM_D10: [05] - CPU IO (U100.7), [06] - DRAM (R126.2)
DRAM_D11: [05] - CPU IO (U100.10), [06] - DRAM (R128.2)
DRAM_D12: [05] - CPU IO (U100.27), [06] - DRAM (R130.2)
DRAM_D13: [05] - CPU IO (U100.28), [06] - DRAM (R131.2)
DRAM_D14: [05] - CPU IO (U100.49), [06] - DRAM (R132.2)
DRAM_D15: [05] - CPU IO (U100.45), [06] - DRAM (R134.2)
DRAM_DQMH: [05] - CPU IO (U100.106), [06] - DRAM (R139.2)
DRAM_DQML: [05] - CPU IO (U100.111), [06] - DRAM (R141.2)
DRAM_RAS: [05] - CPU IO (U100.78), [06] - DRAM (R135.1)
DRAM_WE: [05] - CPU IO (U100.108), [06] - DRAM (R137.1)
ETH_CRS: [05] - CPU IO (U100.126), [07] - ETHERNET (R151.2 U102.15)
ETH_INTP: [05] - CPU IO (U100.129), [07] - ETHERNET (R147.1 U102.18)
ETH_MDC: [05] - CPU IO (U100.113), [07] - ETHERNET (U102.11)
ETH_MDIO: [05] - CPU IO (U100.110), [07] - ETHERNET (R145.1 U102.10)
ETH_REF_CLK: [05] - CPU IO (R102.2), [07] - ETHERNET (U102.16)
ETH_RST: [05] - CPU IO (U100.117), [07] - ETHERNET (C138.2 R146.1 U102.24)
ETH_RXD0: [05] - CPU IO (U100.125), [07] - ETHERNET (U102.13)
ETH_RXD1: [05] - CPU IO (U100.121), [07] - ETHERNET (U102.12)
ETH_RXER: [05] - CPU IO (U100.119), [07] - ETHERNET (R150.2 U102.17)
ETH_TXD0: [05] - CPU IO (U100.131), [07] - ETHERNET (U102.20)
ETH_TXD1: [05] - CPU IO (U100.128), [07] - ETHERNET (U102.21)
ETH_TXEN: [05] - CPU IO (U100.132), [07] - ETHERNET (U102.19)
MMC_CLK: [05] - CPU IO (U100.59), [09] - SD CARD (J101.5)
MMC_CMD: [05] - CPU IO (U100.112), [09] - SD CARD (J101.3 R165.1)
MMC_D0: [05] - CPU IO (U100.116), [09] - SD CARD (J101.7 R161.1)
MMC_D1: [05] - CPU IO (U100.118), [09] - SD CARD (J101.8 R162.1)
MMC_D2: [05] - CPU IO (U100.62), [09] - SD CARD (J101.1 R163.1)
MMC_D3: [05] - CPU IO (U100.70), [09] - SD CARD (J101.2 R164.1)
NetJ101_9: [05] - CPU IO (U100.77), [09] - SD CARD (J101.9 R166.2)
NetJ102_1: [05] - CPU IO (U100.46), [12] - CONNECTORS (J102.1)
NetJ102_2: [05] - CPU IO (U100.47), [12] - CONNECTORS (J102.2)
NetJ102_3: [05] - CPU IO (U100.52), [12] - CONNECTORS (J102.3)
NetJ102_4: [05] - CPU IO (U100.60), [12] - CONNECTORS (J102.4)
NetJ102_5: [05] - CPU IO (U100.63), [12] - CONNECTORS (J102.5)
NetJ102_6: [05] - CPU IO (U100.64), [12] - CONNECTORS (J102.6)
NetJ102_7: [05] - CPU IO (U100.65), [12] - CONNECTORS (J102.7)
NetJ102_8: [05] - CPU IO (U100.67), [12] - CONNECTORS (J102.8)
NetJ102_17: [05] - CPU IO (U100.68), [12] - CONNECTORS (J102.17)
NetJ102_18: [05] - CPU IO (U100.69), [12] - CONNECTORS (J102.18)
NetJ102_19: [05] - CPU IO (U100.25), [12] - CONNECTORS (J102.19)
NetJ102_20: [05] - CPU IO (U100.26), [12] - CONNECTORS (J102.20)
NetJ102_21: [05] - CPU IO (U100.90), [12] - CONNECTORS (J102.21)
NetJ102_22: [05] - CPU IO (U100.91), [12] - CONNECTORS (J102.22)
NetJ102_23: [05] - CPU IO (U100.92), [12] - CONNECTORS (J102.23)
NetJ102_24: [05] - CPU IO (U100.93), [12] - CONNECTORS (J102.24)
NetJ102_29: [05] - CPU IO (U100.21), [12] - CONNECTORS (J102.29)
NetJ102_30: [05] - CPU IO (U100.20), [12] - CONNECTORS (J102.30)
NetJ102_31: [05] - CPU IO (U100.94), [12] - CONNECTORS (J102.31)
NetJ102_32: [05] - CPU IO (U100.97), [12] - CONNECTORS (J102.32)
NetJ102_33: [05] - CPU IO (U100.98), [12] - CONNECTORS (J102.33)
NetJ102_34: [05] - CPU IO (U100.99), [12] - CONNECTORS (J102.34)
NetJ102_35: [05] - CPU IO (U100.100), [12] - CONNECTORS (J102.35)
NetJ102_36: [05] - CPU IO (U100.101), [12] - CONNECTORS (J102.36)
NetJ105_2: [04] - CPU SIGNALS (U100.79), [12] - CONNECTORS (J105.2 R170.1)
NetJ105_4: [04] - CPU SIGNALS (U100.89), [12] - CONNECTORS (J105.4 R171.1)
NetJ105_6: [04] - CPU SIGNALS (U100.109), [12] - CONNECTORS (J105.6)
NetJ105_10: [04] - CPU SIGNALS (U100.83), [10] - LEDS, BUTTONS (SW100.1 SW100.2), [12] - CONNECTORS (J105.10 R172.1)
NetR167_1: [05] - CPU IO (U100.105), [10] - LEDS, BUTTONS (R167.1)
NetR168_1: [05] - CPU IO (U100.103), [10] - LEDS, BUTTONS (R168.1)
NetSW101_1: [05] - CPU IO (U100.73), [10] - LEDS, BUTTONS (SW101.1 SW101.2)
NetT101_1: [05] - CPU IO (U100.114), [12] - CONNECTORS (T101.1)
NetU100_2: [05] - CPU IO (U100.2), [08] - USB (U103.1)
NetU100_66: [05] - CPU IO (U100.66), [08] - USB (U104.1)
NetU100_71: [05] - CPU IO (U100.71), [08] - USB (U103.17)
NetU100_75: [05] - CPU IO (U100.75), [08] - USB (U104.17)
USB1_N: [08] - USB (C147.2 R154.1), [12] - CONNECTORS (J104.2)
USB1_P: [08] - USB (C146.2 R153.1), [12] - CONNECTORS (J104.3)
USB2_N: [08] - USB (C153.2 R158.1), [12] - CONNECTORS (J106.2)
USB2_P: [08] - USB (C152.2 R157.1), [12] - CONNECTORS (J106.3)
USB_HOST_N: [04] - CPU SIGNALS (U100.136), [12] - CONNECTORS (J103.3)
USB_HOST_P: [04] - CPU SIGNALS (U100.137), [12] - CONNECTORS (J103.2)